# EAGLE design rakboard2_pre (EAGLE 7.7.0)
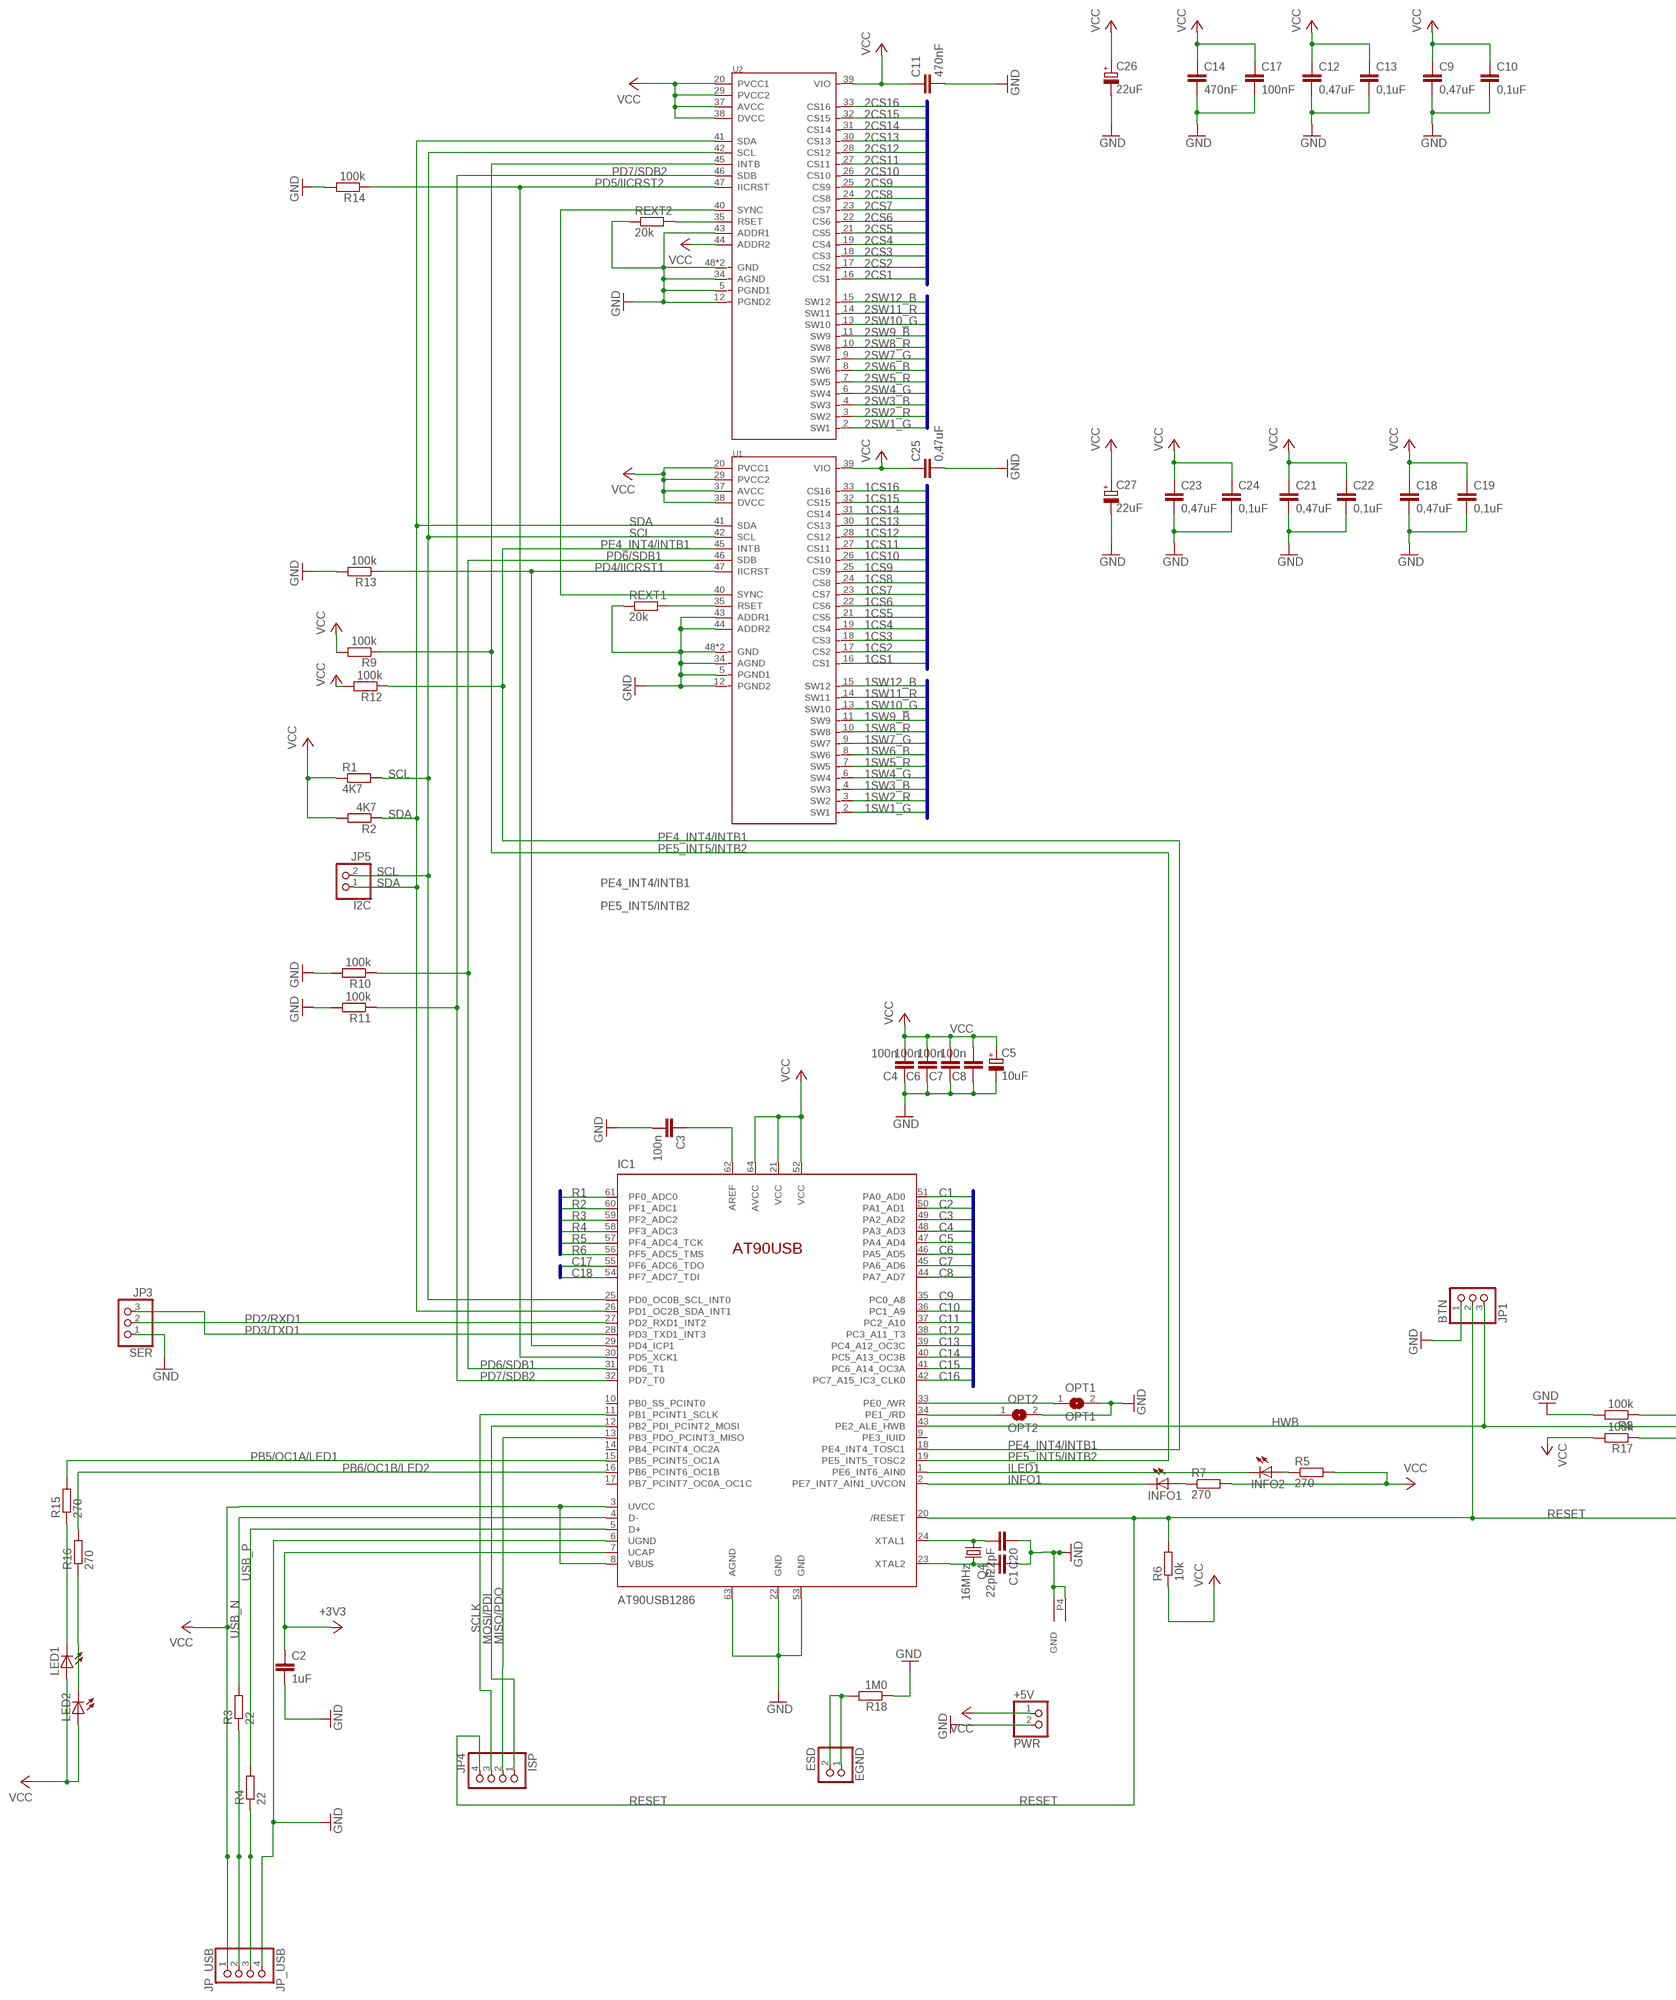
[diagram p0: schematic, sheet 1, part 1 of 2]
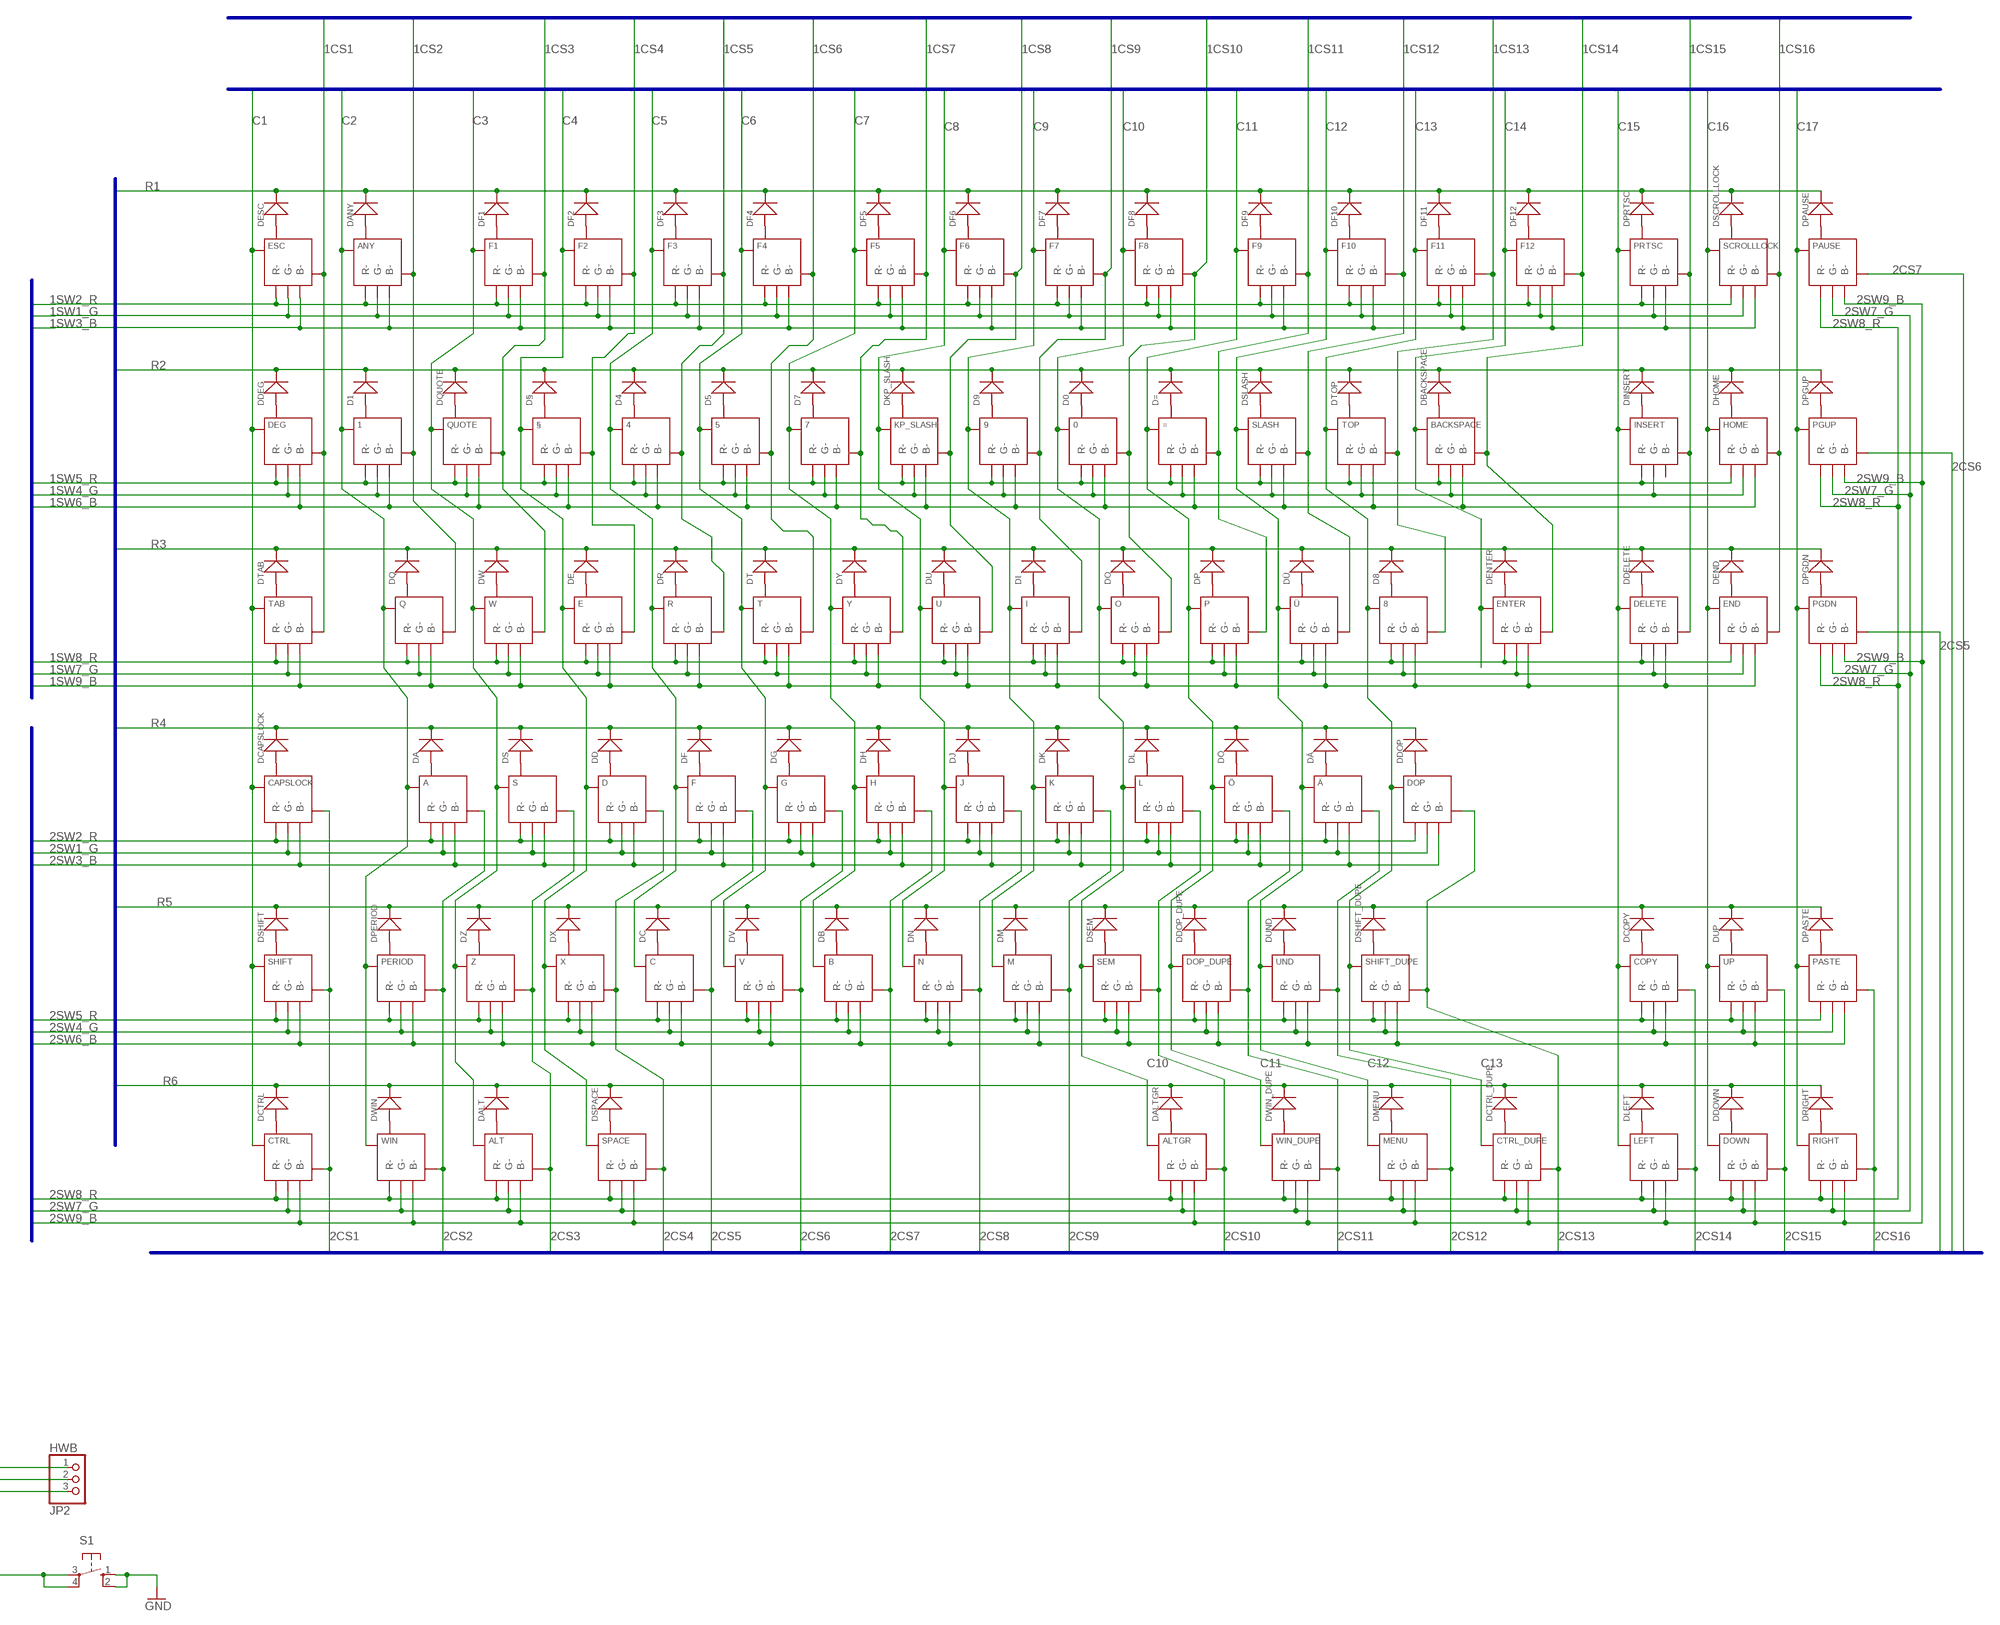
[diagram p1: schematic, sheet 1, part 2 of 2]

## Parts
0  KEYSWITCH-RGBLED-ALPSMX-1U-RGB  [ALPSMX-1U-RGB]
1  KEYSWITCH-RGBLED-ALPSMX-1U-RGB  [ALPSMX-1U-RGB]
4  KEYSWITCH-RGBLED-ALPSMX-1U-RGB  [ALPSMX-1U-RGB]
5  KEYSWITCH-RGBLED-ALPSMX-1U-RGB  [ALPSMX-1U-RGB]
7  KEYSWITCH-RGBLED-ALPSMX-1U-RGB  [ALPSMX-1U-RGB]
8  KEYSWITCH-RGBLED-ALPSMX-1U-RGB  [ALPSMX-1U-RGB]
9  KEYSWITCH-RGBLED-ALPSMX-1U-RGB  [ALPSMX-1U-RGB]
+5V  PWR  PINHD-1X2  [1X02]
=  KEYSWITCH-RGBLED-ALPSMX-1U-RGB  [ALPSMX-1U-RGB]
A  KEYSWITCH-RGBLED-ALPSMX-1U-RGB  [ALPSMX-1U-RGB]
ALT  KEYSWITCH-RGBLED-ALPSMX-1U-RGB  [ALPSMX-1U-RGB]
ALTGR  KEYSWITCH-RGBLED-ALPSMX-1U-RGB  [ALPSMX-1U-RGB]
ANY  KEYSWITCH-RGBLED-ALPSMX-1U-RGB  [ALPSMX-1U-RGB]
B  KEYSWITCH-RGBLED-ALPSMX-1U-RGB  [ALPSMX-1U-RGB]
BACKSPACE  KEYSWITCH-RGBLED-ALPSMX-2U-RGB  [ALPSMX-2U-RGB]
BTN  JP1  PINHD-1X3  [1X03]
C  KEYSWITCH-RGBLED-ALPSMX-1U-RGB  [ALPSMX-1U-RGB]
C1  22pF  C-EUC1206  [C1206]
C2  1uF  C-EUC1206  [C1206]
C3  100n  C-EUC1206  [C1206]
C4  100n  C-EUC1206  [C1206]
C5  10uF  CPOL-EUE2-4  [E2-4]
C6  100n  C-EUC1206  [C1206]
C7  100n  C-EUC1206  [C1206]
C8  100n  C-EUC1206  [C1206]
C9  0,47uF  C-EUC1206  [C1206]
C10  0,1uF  C-EUC1206  [C1206]
C11  470nF  C-EUC1206  [C1206]
C12  0,47uF  C-EUC1206  [C1206]
C13  0,1uF  C-EUC1206  [C1206]
C14  470nF  C-EUC1206  [C1206]
C17  100nF  C-EUC1206  [C1206]
C18  0,47uF  C-EUC1206  [C1206]
C19  0,1uF  C-EUC1206  [C1206]
C20  22pF  C-EUC1206  [C1206]
C21  0,47uF  C-EUC1206  [C1206]
C22  0,1uF  C-EUC1206  [C1206]
C23  0,47uF  C-EUC1206  [C1206]
C24  0,1uF  C-EUC1206  [C1206]
C25  0,47uF  C-EUC1206  [C1206]
C26  22uF  CPOL-EUE2-4  [E2-4]
C27  22uF  CPOL-EUE2-4  [E2-4]
CAPSLOCK  KEYSWITCH-RGBLED-ALPSMX-1U-RGB  [ALPSMX-1U-RGB]
COPY  KEYSWITCH-RGBLED-ALPSMX-1U-RGB  [ALPSMX-1U-RGB]
CTRL  KEYSWITCH-RGBLED-ALPSMX-1U-RGB  [ALPSMX-1U-RGB]
CTRL_DUPE  KEYSWITCH-RGBLED-ALPSMX-1U-RGB  [ALPSMX-1U-RGB]
D  KEYSWITCH-RGBLED-ALPSMX-1U-RGB  [ALPSMX-1U-RGB]
D0  DIODE'1N4148'  [DO-35]
D1  DIODE'1N4148'  [DO-35]
D4  DIODE'1N4148'  [DO-35]
D5  DIODE'1N4148'  [DO-35]
D7  DIODE'1N4148'  [DO-35]
D8  DIODE'1N4148'  [DO-35]
D9  DIODE'1N4148'  [DO-35]
D=  DIODE'1N4148'  [DO-35]
DA  DIODE'1N4148'  [DO-35]
DALT  DIODE'1N4148'  [DO-35]
DALTGR  DIODE'1N4148'  [DO-35]
DANY  DIODE'1N4148'  [DO-35]
DB  DIODE'1N4148'  [DO-35]
DBACKSPACE  DIODE'1N4148'  [DO-35]
DC  DIODE'1N4148'  [DO-35]
DCAPSLOCK  DIODE'1N4148'  [DO-35]
DCOPY  DIODE'1N4148'  [DO-35]
DCTRL  DIODE'1N4148'  [DO-35]
DCTRL_DUPE  DIODE'1N4148'  [DO-35]
DD  DIODE'1N4148'  [DO-35]
DDEG  DIODE'1N4148'  [DO-35]
DDELETE  DIODE'1N4148'  [DO-35]
DDOP  DIODE'1N4148'  [DO-35]
DDOP_DUPE  DIODE'1N4148'  [DO-35]
DDOWN  DIODE'1N4148'  [DO-35]
DE  DIODE'1N4148'  [DO-35]
DEG  KEYSWITCH-RGBLED-ALPSMX-1U-RGB  [ALPSMX-1U-RGB]
DELETE  KEYSWITCH-RGBLED-ALPSMX-1U-RGB  [ALPSMX-1U-RGB]
DEND  DIODE'1N4148'  [DO-35]
DENTER  DIODE'1N4148'  [DO-35]
DESC  DIODE'1N4148'  [DO-35]
DF  DIODE'1N4148'  [DO-35]
DF1  DIODE'1N4148'  [DO-35]
DF2  DIODE'1N4148'  [DO-35]
DF3  DIODE'1N4148'  [DO-35]
DF4  DIODE'1N4148'  [DO-35]
DF5  DIODE'1N4148'  [DO-35]
DF6  DIODE'1N4148'  [DO-35]
DF7  DIODE'1N4148'  [DO-35]
DF8  DIODE'1N4148'  [DO-35]
DF9  DIODE'1N4148'  [DO-35]
DF10  DIODE'1N4148'  [DO-35]
DF11  DIODE'1N4148'  [DO-35]
DF12  DIODE'1N4148'  [DO-35]
DG  DIODE'1N4148'  [DO-35]
DH  DIODE'1N4148'  [DO-35]
DHOME  DIODE'1N4148'  [DO-35]
DI  DIODE'1N4148'  [DO-35]
DINSERT  DIODE'1N4148'  [DO-35]
DJ  DIODE'1N4148'  [DO-35]
DK  DIODE'1N4148'  [DO-35]
DKP_SLASH  DIODE'1N4148'  [DO-35]
DL  DIODE'1N4148'  [DO-35]
DLEFT  DIODE'1N4148'  [DO-35]
DM  DIODE'1N4148'  [DO-35]
DMENU  DIODE'1N4148'  [DO-35]
DN  DIODE'1N4148'  [DO-35]
DO  DIODE'1N4148'  [DO-35]
DOP  KEYSWITCH-RGBLED-ALPSMX-1U-RGB  [ALPSMX-1U-RGB]
DOP_DUPE  KEYSWITCH-RGBLED-ALPSMX-1U-RGB  [ALPSMX-1U-RGB]
DOWN  KEYSWITCH-RGBLED-ALPSMX-1U-RGB  [ALPSMX-1U-RGB]
DP  DIODE'1N4148'  [DO-35]
DPASTE  DIODE'1N4148'  [DO-35]
DPAUSE  DIODE'1N4148'  [DO-35]
DPERIOD  DIODE'1N4148'  [DO-35]
DPGDN  DIODE'1N4148'  [DO-35]
DPGUP  DIODE'1N4148'  [DO-35]
DPRTSC  DIODE'1N4148'  [DO-35]
DQ  DIODE'1N4148'  [DO-35]
DQUOTE  DIODE'1N4148'  [DO-35]
DR  DIODE'1N4148'  [DO-35]
DRIGHT  DIODE'1N4148'  [DO-35]
DS  DIODE'1N4148'  [DO-35]
DSCROLLLOCK  DIODE'1N4148'  [DO-35]
DSEM  DIODE'1N4148'  [DO-35]
DSHIFT  DIODE'1N4148'  [DO-35]
DSHIFT_DUPE  DIODE'1N4148'  [DO-35]
DSLASH  DIODE'1N4148'  [DO-35]
DSPACE  DIODE'1N4148'  [DO-35]
DT  DIODE'1N4148'  [DO-35]
DTAB  DIODE'1N4148'  [DO-35]
DTOP  DIODE'1N4148'  [DO-35]
DU  DIODE'1N4148'  [DO-35]
DUND  DIODE'1N4148'  [DO-35]
DUP  DIODE'1N4148'  [DO-35]
DV  DIODE'1N4148'  [DO-35]
DW  DIODE'1N4148'  [DO-35]
DWIN  DIODE'1N4148'  [DO-35]
DWIN_DUPE  DIODE'1N4148'  [DO-35]
DX  DIODE'1N4148'  [DO-35]
DY  DIODE'1N4148'  [DO-35]
DZ  DIODE'1N4148'  [DO-35]
D§  DIODE'1N4148'  [DO-35]
DÄ  DIODE'1N4148'  [DO-35]
DÖ  DIODE'1N4148'  [DO-35]
DÜ  DIODE'1N4148'  [DO-35]
E  KEYSWITCH-RGBLED-ALPSMX-1U-RGB  [ALPSMX-1U-RGB]
EGND  ESD  PINHD-1X2  [1X02]
END  KEYSWITCH-RGBLED-ALPSMX-1U-RGB  [ALPSMX-1U-RGB]
ENTER  KEYSWITCH-RGBLED-ALPSMX-2U-RGB  [ALPSMX-2U-RGB]
ESC  KEYSWITCH-RGBLED-ALPSMX-1U-RGB  [ALPSMX-1U-RGB]
F  KEYSWITCH-RGBLED-ALPSMX-1U-RGB  [ALPSMX-1U-RGB]
F1  KEYSWITCH-RGBLED-ALPSMX-1U-RGB  [ALPSMX-1U-RGB]
F2  KEYSWITCH-RGBLED-ALPSMX-1U-RGB  [ALPSMX-1U-RGB]
F3  KEYSWITCH-RGBLED-ALPSMX-1U-RGB  [ALPSMX-1U-RGB]
F4  KEYSWITCH-RGBLED-ALPSMX-1U-RGB  [ALPSMX-1U-RGB]
F5  KEYSWITCH-RGBLED-ALPSMX-1U-RGB  [ALPSMX-1U-RGB]
F6  KEYSWITCH-RGBLED-ALPSMX-1U-RGB  [ALPSMX-1U-RGB]
F7  KEYSWITCH-RGBLED-ALPSMX-1U-RGB  [ALPSMX-1U-RGB]
F8  KEYSWITCH-RGBLED-ALPSMX-1U-RGB  [ALPSMX-1U-RGB]
F9  KEYSWITCH-RGBLED-ALPSMX-1U-RGB  [ALPSMX-1U-RGB]
F10  KEYSWITCH-RGBLED-ALPSMX-1U-RGB  [ALPSMX-1U-RGB]
F11  KEYSWITCH-RGBLED-ALPSMX-1U-RGB  [ALPSMX-1U-RGB]
F12  KEYSWITCH-RGBLED-ALPSMX-1U-RGB  [ALPSMX-1U-RGB]
G  KEYSWITCH-RGBLED-ALPSMX-1U-RGB  [ALPSMX-1U-RGB]
H  KEYSWITCH-RGBLED-ALPSMX-1U-RGB  [ALPSMX-1U-RGB]
HOME  KEYSWITCH-RGBLED-ALPSMX-1U-RGB  [ALPSMX-1U-RGB]
HWB  JP2  PINHD-1X3  [1X03]
I  KEYSWITCH-RGBLED-ALPSMX-1U-RGB  [ALPSMX-1U-RGB]
I2C  JP5  PINHD-1X2  [1X02]
IC1  AT90USB1286  AT90USB-TQFP  [TQFP64]
INFO1  LEDSML0805  [SML0805]
INFO2  LEDSML0805  [SML0805]
INSERT  KEYSWITCH-RGBLED-ALPSMX-1U-RGB  [ALPSMX-1U-RGB]
ISP  JP4  PINHD-1X4  [1X04]
J  KEYSWITCH-RGBLED-ALPSMX-1U-RGB  [ALPSMX-1U-RGB]
JP_USB  JP_USB  PINHD-1X4  [1X04]
K  KEYSWITCH-RGBLED-ALPSMX-1U-RGB  [ALPSMX-1U-RGB]
KP_SLASH  KEYSWITCH-RGBLED-ALPSMX-1U-RGB  [ALPSMX-1U-RGB]
L  KEYSWITCH-RGBLED-ALPSMX-1U-RGB  [ALPSMX-1U-RGB]
LED1  LED3MM  [LED3MM]
LED2  LED3MM  [LED3MM]
LEFT  KEYSWITCH-RGBLED-ALPSMX-1U-RGB  [ALPSMX-1U-RGB]
M  KEYSWITCH-RGBLED-ALPSMX-1U-RGB  [ALPSMX-1U-RGB]
MENU  KEYSWITCH-RGBLED-ALPSMX-1U-RGB  [ALPSMX-1U-RGB]
N  KEYSWITCH-RGBLED-ALPSMX-1U-RGB  [ALPSMX-1U-RGB]
O  KEYSWITCH-RGBLED-ALPSMX-1U-RGB  [ALPSMX-1U-RGB]
OPT1  OPT1  SJ  [SJ]
OPT2  OPT2  SJ  [SJ]
P  KEYSWITCH-RGBLED-ALPSMX-1U-RGB  [ALPSMX-1U-RGB]
PASTE  KEYSWITCH-RGBLED-ALPSMX-1U-RGB  [ALPSMX-1U-RGB]
PAUSE  KEYSWITCH-RGBLED-ALPSMX-1U-RGB  [ALPSMX-1U-RGB]
PERIOD  KEYSWITCH-RGBLED-ALPSMX-1U-RGB  [ALPSMX-1U-RGB]
PGDN  KEYSWITCH-RGBLED-ALPSMX-1U-RGB  [ALPSMX-1U-RGB]
PGUP  KEYSWITCH-RGBLED-ALPSMX-1U-RGB  [ALPSMX-1U-RGB]
PRTSC  KEYSWITCH-RGBLED-ALPSMX-1U-RGB  [ALPSMX-1U-RGB]
Q  KEYSWITCH-RGBLED-ALPSMX-1U-RGB  [ALPSMX-1U-RGB]
Q4  16MHz  CRYSTALMJ  [MJ]
QUOTE  KEYSWITCH-RGBLED-ALPSMX-1U-RGB  [ALPSMX-1U-RGB]
R  KEYSWITCH-RGBLED-ALPSMX-1U-RGB  [ALPSMX-1U-RGB]
R1  4K7  R-EU_R1206  [R1206]
R2  4K7  R-EU_R1206  [R1206]
R3  22  R-EU_R1206  [R1206]
R4  22  R-EU_R1206  [R1206]
R5  270  R-EU_R1206  [R1206]
R6  10k  R-EU_R1206  [R1206]
R7  270  R-EU_R1206  [R1206]
R8  100k  R-EU_R1206  [R1206]
R9  100k  R-EU_R1206  [R1206]
R10  100k  R-EU_R1206  [R1206]
R11  100k  R-EU_R1206  [R1206]
R12  100k  R-EU_R1206  [R1206]
R13  100k  R-EU_R1206  [R1206]
R14  100k  R-EU_R1206  [R1206]
R15  270  R-EU_R1206  [R1206]
R16  270  R-EU_R1206  [R1206]
R17  100k  R-EU_R1206  [R1206]
R18  1M0  R-EU_R1206  [R1206]
REXT1  20k  R-EU_R1206  [R1206]
REXT2  20k  R-EU_R1206  [R1206]
RIGHT  KEYSWITCH-RGBLED-ALPSMX-1U-RGB  [ALPSMX-1U-RGB]
S  KEYSWITCH-RGBLED-ALPSMX-1U-RGB  [ALPSMX-1U-RGB]
S1  10-XX  [B3F-10XX]
SCROLLLOCK  KEYSWITCH-RGBLED-ALPSMX-1U-RGB  [ALPSMX-1U-RGB]
SEM  KEYSWITCH-RGBLED-ALPSMX-1U-RGB  [ALPSMX-1U-RGB]
SER  JP3  PINHD-1X3  [1X03]
SHIFT  KEYSWITCH-RGBLED-ALPSMX-1U-RGB  [ALPSMX-1U-RGB]
SHIFT_DUPE  KEYSWITCH-RGBLED-ALPSMX-2U-RGB  [ALPSMX-2U-RGB]
SLASH  KEYSWITCH-RGBLED-ALPSMX-1U-RGB  [ALPSMX-1U-RGB]
SPACE  KEYSWITCH-RGBLED-ALPSMX-6.25U-RGB  [ALPSMX-6.25U-RGB]
T  KEYSWITCH-RGBLED-ALPSMX-1U-RGB  [ALPSMX-1U-RGB]
TAB  KEYSWITCH-RGBLED-ALPSMX-1U-RGB  [ALPSMX-1U-RGB]
TOP  KEYSWITCH-RGBLED-ALPSMX-1U-RGB  [ALPSMX-1U-RGB]
U  KEYSWITCH-RGBLED-ALPSMX-1U-RGB  [ALPSMX-1U-RGB]
U1  IS31FL3733  [LQFP48_7X7]
U2  IS31FL3733  [LQFP48_7X7]
UND  KEYSWITCH-RGBLED-ALPSMX-1U-RGB  [ALPSMX-1U-RGB]
UP  KEYSWITCH-RGBLED-ALPSMX-1U-RGB  [ALPSMX-1U-RGB]
V  KEYSWITCH-RGBLED-ALPSMX-1U-RGB  [ALPSMX-1U-RGB]
W  KEYSWITCH-RGBLED-ALPSMX-1U-RGB  [ALPSMX-1U-RGB]
WIN  KEYSWITCH-RGBLED-ALPSMX-1U-RGB  [ALPSMX-1U-RGB]
WIN_DUPE  KEYSWITCH-RGBLED-ALPSMX-1U-RGB  [ALPSMX-1U-RGB]
X  KEYSWITCH-RGBLED-ALPSMX-1U-RGB  [ALPSMX-1U-RGB]
Y  KEYSWITCH-RGBLED-ALPSMX-1U-RGB  [ALPSMX-1U-RGB]
Z  KEYSWITCH-RGBLED-ALPSMX-1U-RGB  [ALPSMX-1U-RGB]
§  KEYSWITCH-RGBLED-ALPSMX-1U-RGB  [ALPSMX-1U-RGB]
Ä  KEYSWITCH-RGBLED-ALPSMX-1U-RGB  [ALPSMX-1U-RGB]
Ö  KEYSWITCH-RGBLED-ALPSMX-1U-RGB  [ALPSMX-1U-RGB]
Ü  KEYSWITCH-RGBLED-ALPSMX-1U-RGB  [ALPSMX-1U-RGB]

## Nets
1CS1 [leddriver]: DEG.LED+ ESC.LED+ TAB.LED+ U1.16(CS1)
1CS2 [leddriver]: 1.LED+ ANY.LED+ Q.LED+ U1.17(CS2)
1CS3 [leddriver]: F1.LED+ QUOTE.LED+ U1.18(CS3) W.LED+
1CS4 [leddriver]: E.LED+ F2.LED+ U1.19(CS4) §.LED+
1CS5 [leddriver]: 4.LED+ F3.LED+ R.LED+ U1.21(CS5)
1CS6 [leddriver]: 5.LED+ F4.LED+ T.LED+ U1.22(CS6)
1CS7 [leddriver]: 7.LED+ F5.LED+ U1.23(CS7) Y.LED+
1CS8 [leddriver]: F6.LED+ KP_SLASH.LED+ U1.24(CS8) U.LED+
1CS9 [leddriver]: 9.LED+ F7.LED+ I.LED+ U1.25(CS9)
1CS10 [leddriver]: 0.LED+ F8.LED+ O.LED+ U1.26(CS10)
1CS11 [leddriver]: =.LED+ F9.LED+ P.LED+ U1.27(CS11)
1CS12 [leddriver]: F10.LED+ SLASH.LED+ U1.28(CS12) Ü.LED+
1CS13 [leddriver]: 8.LED+ F11.LED+ TOP.LED+ U1.30(CS13)
1CS14 [leddriver]: BACKSPACE.LED+ ENTER.LED+ F12.LED+ U1.31(CS14)
1CS15 [leddriver]: DELETE.LED+ INSERT.LED+ PRTSC.LED+ U1.32(CS15)
1CS16 [leddriver]: END.LED+ HOME.LED+ SCROLLLOCK.LED+ U1.33(CS16)
1SW1_G [leddriver]: ANY.G- ESC.G- F1.G- F2.G- F3.G- F4.G- F5.G- F6.G- F7.G- F8.G- F9.G- F10.G- F11.G- F12.G- PRTSC.G- SCROLLLOCK.G- U1.2(SW1)
1SW2_R [leddriver]: ANY.R- ESC.R- F1.R- F2.R- F3.R- F4.R- F5.R- F6.R- F7.R- F8.R- F9.R- F10.R- F11.R- F12.R- PRTSC.R- SCROLLLOCK.R- U1.3(SW2)
1SW3_B [leddriver]: ANY.B- ESC.B- F1.B- F2.B- F3.B- F4.B- F5.B- F6.B- F7.B- F8.B- F9.B- F10.B- F11.B- F12.B- PRTSC.B- SCROLLLOCK.B- U1.4(SW3)
1SW4_G [leddriver]: 0.G- 1.G- 4.G- 5.G- 7.G- 9.G- =.G- BACKSPACE.G- DEG.G- HOME.G- INSERT.G- KP_SLASH.G- QUOTE.G- SLASH.G- TOP.G- U1.6(SW4) §.G-
1SW5_R [leddriver]: 0.R- 1.R- 4.R- 5.R- 7.R- 9.R- =.R- BACKSPACE.R- DEG.R- HOME.R- INSERT.R- KP_SLASH.R- QUOTE.R- SLASH.R- TOP.R- U1.7(SW5) §.R-
1SW6_B: 0.B- 1.B- 4.B- 5.B- 7.B- 9.B- =.B- BACKSPACE.B- DEG.B- HOME.B- KP_SLASH.B- QUOTE.B- SLASH.B- TOP.B- U1.8(SW6) §.B-
1SW7_G [leddriver]: 8.G- DELETE.G- E.G- END.G- ENTER.G- I.G- O.G- P.G- Q.G- R.G- T.G- TAB.G- U1.9(SW7) U.G- W.G- Y.G- Ü.G-
1SW8_R [leddriver]: 8.R- DELETE.R- E.R- END.R- ENTER.R- I.R- O.R- P.R- Q.R- R.R- T.R- TAB.R- U1.10(SW8) U.R- W.R- Y.R- Ü.R-
1SW9_B [leddriver]: 8.B- DELETE.B- E.B- END.B- ENTER.B- I.B- O.B- P.B- Q.B- R.B- T.B- TAB.B- U1.11(SW9) U.B- W.B- Y.B- Ü.B-
1SW10_G [leddriver]: U1.13(SW10)
1SW11_R [leddriver]: U1.14(SW11)
1SW12_B [leddriver]: U1.15(SW12)
2CS1 [leddriver]: CAPSLOCK.LED+ CTRL.LED+ SHIFT.LED+ U2.16(CS1)
2CS2 [leddriver]: A.LED+ PERIOD.LED+ U2.17(CS2) WIN.LED+
2CS3 [leddriver]: ALT.LED+ S.LED+ U2.18(CS3) Z.LED+
2CS4 [leddriver]: D.LED+ SPACE.LED+ U2.19(CS4) X.LED+
2CS5 [leddriver]: C.LED+ F.LED+ PGDN.LED+ U2.21(CS5)
2CS6 [leddriver]: G.LED+ PGUP.LED+ U2.22(CS6) V.LED+
2CS7 [leddriver]: B.LED+ H.LED+ PAUSE.LED+ U2.23(CS7)
2CS8 [leddriver]: J.LED+ N.LED+ U2.24(CS8)
2CS9 [leddriver]: K.LED+ M.LED+ U2.25(CS9)
2CS10 [leddriver]: ALTGR.LED+ L.LED+ SEM.LED+ U2.26(CS10)
2CS11 [leddriver]: DOP_DUPE.LED+ U2.27(CS11) WIN_DUPE.LED+ Ö.LED+
2CS12 [leddriver]: MENU.LED+ U2.28(CS12) UND.LED+ Ä.LED+
2CS13 [leddriver]: CTRL_DUPE.LED+ DOP.LED+ SHIFT_DUPE.LED+ U2.30(CS13)
2CS14 [leddriver]: COPY.LED+ LEFT.LED+ U2.31(CS14)
2CS15 [leddriver]: DOWN.LED+ U2.32(CS15) UP.LED+
2CS16 [leddriver]: PASTE.LED+ RIGHT.LED+ U2.33(CS16)
2SW1_G [leddriver]: A.G- CAPSLOCK.G- D.G- DOP.G- F.G- G.G- H.G- J.G- K.G- L.G- S.G- U2.2(SW1) Ä.G- Ö.G-
2SW2_R [leddriver]: A.R- CAPSLOCK.R- D.R- DOP.R- F.R- G.R- H.R- J.R- K.R- L.R- S.R- U2.3(SW2) Ä.R- Ö.R-
2SW3_B [leddriver]: A.B- CAPSLOCK.B- D.B- DOP.B- F.B- G.B- H.B- J.B- K.B- L.B- S.B- U2.4(SW3) Ä.B- Ö.B-
2SW4_G [leddriver]: B.G- C.G- COPY.G- DOP_DUPE.G- M.G- N.G- PASTE.G- PERIOD.G- SEM.G- SHIFT.G- SHIFT_DUPE.G- U2.6(SW4) UND.G- UP.G- V.G- X.G- Z.G-
2SW5_R [leddriver]: B.R- C.R- COPY.R- DOP_DUPE.R- M.R- N.R- PASTE.R- PERIOD.R- SEM.R- SHIFT.R- SHIFT_DUPE.R- U2.7(SW5) UND.R- UP.R- V.R- X.R- Z.R-
2SW6_B [leddriver]: B.B- C.B- COPY.B- DOP_DUPE.B- M.B- N.B- PASTE.B- PERIOD.B- SEM.B- SHIFT.B- SHIFT_DUPE.B- U2.8(SW6) UND.B- UP.B- V.B- X.B- Z.B-
2SW7_G [leddriver]: ALT.G- ALTGR.G- CTRL.G- CTRL_DUPE.G- DOWN.G- LEFT.G- MENU.G- PAUSE.G- PGDN.G- PGUP.G- RIGHT.G- SPACE.G- U2.9(SW7) WIN.G- WIN_DUPE.G-
2SW8_R [leddriver]: ALT.R- ALTGR.R- CTRL.R- CTRL_DUPE.R- DOWN.R- LEFT.R- MENU.R- PAUSE.R- PGDN.R- PGUP.R- RIGHT.R- SPACE.R- U2.10(SW8) WIN.R- WIN_DUPE.R-
2SW9_B [leddriver]: ALT.B- ALTGR.B- CTRL.B- CTRL_DUPE.B- DOWN.B- LEFT.B- MENU.B- PAUSE.B- PGDN.B- PGUP.B- RIGHT.B- SPACE.B- U2.11(SW9) WIN.B- WIN_DUPE.B-
2SW10_G [leddriver]: U2.13(SW10)
2SW11_R [leddriver]: U2.14(SW11)
2SW12_B [leddriver]: U2.15(SW12)
+3V3: C2.1 IC1.7(UCAP)
C1 [keyboard]: CAPSLOCK.ALPS1(P0) CAPSLOCK.MX1(P0) CTRL.ALPS1(P0) CTRL.MX1(P0) DEG.ALPS1(P0) DEG.MX1(P0) ESC.ALPS1(P0) ESC.MX1(P0) IC1.51(PA0_AD0) SHIFT.ALPS1(P0) SHIFT.MX1(P0) TAB.ALPS1(P0) TAB.MX1(P0)
C2 [keyboard]: 1.ALPS1(P0) 1.MX1(P0) A.ALPS1(P0) A.MX1(P0) ANY.ALPS1(P0) ANY.MX1(P0) IC1.50(PA1_AD1) PERIOD.ALPS1(P0) PERIOD.MX1(P0) Q.ALPS1(P0) Q.MX1(P0) WIN.ALPS1(P0) WIN.MX1(P0)
C3 [keyboard]: ALT.ALPS1(P0) ALT.MX1(P0) F1.ALPS1(P0) F1.MX1(P0) IC1.49(PA2_AD2) QUOTE.ALPS1(P0) QUOTE.MX1(P0) S.ALPS1(P0) S.MX1(P0) W.ALPS1(P0) W.MX1(P0) Z.ALPS1(P0) Z.MX1(P0)
C4 [keyboard]: D.ALPS1(P0) D.MX1(P0) E.ALPS1(P0) E.MX1(P0) F2.ALPS1(P0) F2.MX1(P0) IC1.48(PA3_AD3) SPACE.ALPS1(P0) SPACE.MX1(P0) X.ALPS1(P0) X.MX1(P0) §.ALPS1(P0) §.MX1(P0)
C5 [keyboard]: 4.ALPS1(P0) 4.MX1(P0) C.ALPS1(P0) C.MX1(P0) F3.ALPS1(P0) F3.MX1(P0) F.ALPS1(P0) F.MX1(P0) IC1.47(PA4_AD4) R.ALPS1(P0) R.MX1(P0)
C6 [keyboard]: 5.ALPS1(P0) 5.MX1(P0) F4.ALPS1(P0) F4.MX1(P0) G.ALPS1(P0) G.MX1(P0) IC1.46(PA5_AD5) T.ALPS1(P0) T.MX1(P0) V.ALPS1(P0) V.MX1(P0)
C7 [keyboard]: 7.ALPS1(P0) 7.MX1(P0) B.ALPS1(P0) B.MX1(P0) F5.ALPS1(P0) F5.MX1(P0) H.ALPS1(P0) H.MX1(P0) IC1.45(PA6_AD6) Y.ALPS1(P0) Y.MX1(P0)
C8 [keyboard]: F6.ALPS1(P0) F6.MX1(P0) IC1.44(PA7_AD7) J.ALPS1(P0) J.MX1(P0) KP_SLASH.ALPS1(P0) KP_SLASH.MX1(P0) N.ALPS1(P0) N.MX1(P0) U.ALPS1(P0) U.MX1(P0)
C9 [keyboard]: 9.ALPS1(P0) 9.MX1(P0) F7.ALPS1(P0) F7.MX1(P0) I.ALPS1(P0) I.MX1(P0) IC1.35(PC0_A8) K.ALPS1(P0) K.MX1(P0) M.ALPS1(P0) M.MX1(P0)
C10 [keyboard]: 0.ALPS1(P0) 0.MX1(P0) ALTGR.ALPS1(P0) ALTGR.MX1(P0) F8.ALPS1(P0) F8.MX1(P0) IC1.36(PC1_A9) L.ALPS1(P0) L.MX1(P0) O.ALPS1(P0) O.MX1(P0) SEM.ALPS1(P0) SEM.MX1(P0)
C11 [keyboard]: =.ALPS1(P0) =.MX1(P0) DOP_DUPE.ALPS1(P0) DOP_DUPE.MX1(P0) F9.ALPS1(P0) F9.MX1(P0) IC1.37(PC2_A10) P.ALPS1(P0) P.MX1(P0) WIN_DUPE.ALPS1(P0) WIN_DUPE.MX1(P0) Ö.ALPS1(P0) Ö.MX1(P0)
C12 [keyboard]: F10.ALPS1(P0) F10.MX1(P0) IC1.38(PC3_A11_T3) MENU.ALPS1(P0) MENU.MX1(P0) SLASH.ALPS1(P0) SLASH.MX1(P0) UND.ALPS1(P0) UND.MX1(P0) Ä.ALPS1(P0) Ä.MX1(P0) Ü.ALPS1(P0) Ü.MX1(P0)
C13 [keyboard]: 8.ALPS1(P0) 8.MX1(P0) CTRL_DUPE.ALPS1(P0) CTRL_DUPE.MX1(P0) DOP.ALPS1(P0) DOP.MX1(P0) F11.ALPS1(P0) F11.MX1(P0) IC1.39(PC4_A12_OC3C) SHIFT_DUPE.ALPS1(P0) SHIFT_DUPE.MX1(P0) TOP.ALPS1(P0) TOP.MX1(P0)
C14 [keyboard]: BACKSPACE.ALPS1(P0) BACKSPACE.MX1(P0) ENTER.ALPS1(P0) ENTER.MX1(P0) F12.ALPS1(P0) F12.MX1(P0) IC1.40(PC5_A13_OC3B)
C15 [keyboard]: COPY.ALPS1(P0) COPY.MX1(P0) DELETE.ALPS1(P0) DELETE.MX1(P0) IC1.41(PC6_A14_OC3A) INSERT.ALPS1(P0) INSERT.MX1(P0) LEFT.ALPS1(P0) LEFT.MX1(P0) PRTSC.ALPS1(P0) PRTSC.MX1(P0)
C16 [keyboard]: DOWN.ALPS1(P0) DOWN.MX1(P0) END.ALPS1(P0) END.MX1(P0) HOME.ALPS1(P0) HOME.MX1(P0) IC1.42(PC7_A15_IC3_CLK0) SCROLLLOCK.ALPS1(P0) SCROLLLOCK.MX1(P0) UP.ALPS1(P0) UP.MX1(P0)
C17 [keyboard]: IC1.55(PF6_ADC6_TDO) PASTE.ALPS1(P0) PASTE.MX1(P0) PAUSE.ALPS1(P0) PAUSE.MX1(P0) PGDN.ALPS1(P0) PGDN.MX1(P0) PGUP.ALPS1(P0) PGUP.MX1(P0) RIGHT.ALPS1(P0) RIGHT.MX1(P0)
C18: IC1.54(PF7_ADC7_TDI)
GND [gnd]: +5V.2 BTN.1 C1.1 C2.2 C3.2 C4.1 C5.- C6.1 C7.1 C8.1 C9.2 C10.2 C11.2 C12.2 C13.2 C14.2 C17.2 C18.2 C19.2 C20.1 C21.2 C22.2 C23.2 C24.2 C25.2 C26.- C27.- IC1.6(UGND) IC1.22(GND) IC1.53(GND) IC1.63(AGND) JP_USB.4 OPT1.2 OPT2.2 Q4.P2(GND) Q4.P4(GND1) R8.2 R10.2 R11.2 R13.2 R14.2 R18.1 REXT1.1 REXT2.1 S1.1(S) S1.2(S1) SER.1 U1.5(PGND1) U1.12(PGND2) U1.34(AGND) U1.43(ADDR1) U1.44(ADDR2) U1.48(GND) U1.TP(GND) U2.5(PGND1) U2.12(PGND2) U2.34(AGND) U2.43(ADDR1) U2.48(GND) U2.TP(GND)
HWB: BTN.3 HWB.2 IC1.43(PE2_ALE_HWB)
ILED1: IC1.1(PE6_INT6_AIN0) INFO2.C
INFO1: IC1.2(PE7_INT7_AIN1_UVCON) INFO1.C
ISSI_SYNC: U1.40(SYNC) U2.40(SYNC)
MISO/PDO: IC1.13(PB3_PDO_PCINT3_MISO) ISP.2
MOSI/PDI: IC1.12(PB2_PDI_PCINT2_MOSI) ISP.1
N$1: DESC.A(+) ESC.ALPS2(P1) ESC.MX2(P1)
N$3: INFO1.A R7.1
N$6: REXT1.2 U1.35(RSET)
N$8: REXT2.2 U2.35(RSET)
N$9: HWB.1 R8.1
N$10: EGND.1 EGND.2 R18.2
N$11: ANY.ALPS2(P1) ANY.MX2(P1) DANY.A(+)
N$12: DF1.A(+) F1.ALPS2(P1) F1.MX2(P1)
N$13: DF2.A(+) F2.ALPS2(P1) F2.MX2(P1)
N$14: DF3.A(+) F3.ALPS2(P1) F3.MX2(P1)
N$15: DF4.A(+) F4.ALPS2(P1) F4.MX2(P1)
N$16: DF5.A(+) F5.ALPS2(P1) F5.MX2(P1)
N$17: DF6.A(+) F6.ALPS2(P1) F6.MX2(P1)
N$18: DF7.A(+) F7.ALPS2(P1) F7.MX2(P1)
N$19: DF8.A(+) F8.ALPS2(P1) F8.MX2(P1)
N$20: DF9.A(+) F9.ALPS2(P1) F9.MX2(P1)
N$21: DF10.A(+) F10.ALPS2(P1) F10.MX2(P1)
N$22: DF11.A(+) F11.ALPS2(P1) F11.MX2(P1)
N$23: HWB.3 R17.1
N$24: C3.1 IC1.62(AREF)
N$26: DF12.A(+) F12.ALPS2(P1) F12.MX2(P1)
N$27: DPRTSC.A(+) PRTSC.ALPS2(P1) PRTSC.MX2(P1)
N$28: DSCROLLLOCK.A(+) SCROLLLOCK.ALPS2(P1) SCROLLLOCK.MX2(P1)
N$29: DPAUSE.A(+) PAUSE.ALPS2(P1) PAUSE.MX2(P1)
N$30: DDEG.A(+) DEG.ALPS2(P1) DEG.MX2(P1)
N$31: 1.ALPS2(P1) 1.MX2(P1) D1.A(+)
N$32: DQUOTE.A(+) QUOTE.ALPS2(P1) QUOTE.MX2(P1)
N$33: D§.A(+) §.ALPS2(P1) §.MX2(P1)
N$34: 4.ALPS2(P1) 4.MX2(P1) D4.A(+)
N$35: 5.ALPS2(P1) 5.MX2(P1) D5.A(+)
N$36: 7.ALPS2(P1) 7.MX2(P1) D7.A(+)
N$37: IC1.33(PE0_/WR) OPT1.1
N$38: DKP_SLASH.A(+) KP_SLASH.ALPS2(P1) KP_SLASH.MX2(P1)
N$40: IC1.34(PE1_/RD) OPT2.1
N$41: 9.ALPS2(P1) 9.MX2(P1) D9.A(+)
N$42: 0.ALPS2(P1) 0.MX2(P1) D0.A(+)
N$43: =.ALPS2(P1) =.MX2(P1) D=.A(+)
N$44: INFO2.A R5.1
N$46: DSLASH.A(+) SLASH.ALPS2(P1) SLASH.MX2(P1)
N$48: DTOP.A(+) TOP.ALPS2(P1) TOP.MX2(P1)
N$49: BACKSPACE.ALPS2(P1) BACKSPACE.MX2(P1) DBACKSPACE.A(+)
N$50: DINSERT.A(+) INSERT.ALPS2(P1) INSERT.MX2(P1)
N$51: DHOME.A(+) HOME.ALPS2(P1) HOME.MX2(P1)
N$52: DPGUP.A(+) PGUP.ALPS2(P1) PGUP.MX2(P1)
N$53: DTAB.A(+) TAB.ALPS2(P1) TAB.MX2(P1)
N$54: DQ.A(+) Q.ALPS2(P1) Q.MX2(P1)
N$55: DW.A(+) W.ALPS2(P1) W.MX2(P1)
N$56: DE.A(+) E.ALPS2(P1) E.MX2(P1)
N$57: DR.A(+) R.ALPS2(P1) R.MX2(P1)
N$58: DT.A(+) T.ALPS2(P1) T.MX2(P1)
N$59: DY.A(+) Y.ALPS2(P1) Y.MX2(P1)
N$60: DU.A(+) U.ALPS2(P1) U.MX2(P1)
N$61: DI.A(+) I.ALPS2(P1) I.MX2(P1)
N$62: DO.A(+) O.ALPS2(P1) O.MX2(P1)
N$63: DP.A(+) P.ALPS2(P1) P.MX2(P1)
N$64: C1.2 IC1.23(XTAL2) Q4.P3
N$65: C20.2 IC1.24(XTAL1) Q4.P1
N$66: DÜ.A(+) Ü.ALPS2(P1) Ü.MX2(P1)
N$67: LED1.K(C) R15.1
N$68: LED2.K(C) R16.1
N$70: 8.ALPS2(P1) 8.MX2(P1) D8.A(+)
N$71: DENTER.A(+) ENTER.ALPS2(P1) ENTER.MX2(P1)
N$72: DDELETE.A(+) DELETE.ALPS2(P1) DELETE.MX2(P1)
N$73: DEND.A(+) END.ALPS2(P1) END.MX2(P1)
N$75: DPGDN.A(+) PGDN.ALPS2(P1) PGDN.MX2(P1)
N$76: CAPSLOCK.ALPS2(P1) CAPSLOCK.MX2(P1) DCAPSLOCK.A(+)
N$77: A.ALPS2(P1) A.MX2(P1) DA.A(+)
N$78: DS.A(+) S.ALPS2(P1) S.MX2(P1)
N$79: D.ALPS2(P1) D.MX2(P1) DD.A(+)
N$80: DF.A(+) F.ALPS2(P1) F.MX2(P1)
N$81: DG.A(+) G.ALPS2(P1) G.MX2(P1)
N$82: DH.A(+) H.ALPS2(P1) H.MX2(P1)
N$83: DJ.A(+) J.ALPS2(P1) J.MX2(P1)
N$84: DK.A(+) K.ALPS2(P1) K.MX2(P1)
N$85: DL.A(+) L.ALPS2(P1) L.MX2(P1)
N$86: DÖ.A(+) Ö.ALPS2(P1) Ö.MX2(P1)
N$87: DÄ.A(+) Ä.ALPS2(P1) Ä.MX2(P1)
N$88: DDOP.A(+) DOP.ALPS2(P1) DOP.MX2(P1)
N$89: DSHIFT.A(+) SHIFT.ALPS2(P1) SHIFT.MX2(P1)
N$90: DPERIOD.A(+) PERIOD.ALPS2(P1) PERIOD.MX2(P1)
N$91: DZ.A(+) Z.ALPS2(P1) Z.MX2(P1)
N$92: DX.A(+) X.ALPS2(P1) X.MX2(P1)
N$93: C.ALPS2(P1) C.MX2(P1) DC.A(+)
N$94: DV.A(+) V.ALPS2(P1) V.MX2(P1)
N$95: B.ALPS2(P1) B.MX2(P1) DB.A(+)
N$96: DN.A(+) N.ALPS2(P1) N.MX2(P1)
N$97: DM.A(+) M.ALPS2(P1) M.MX2(P1)
N$98: DSEM.A(+) SEM.ALPS2(P1) SEM.MX2(P1)
N$99: DDOP_DUPE.A(+) DOP_DUPE.ALPS2(P1) DOP_DUPE.MX2(P1)
N$100: DUND.A(+) UND.ALPS2(P1) UND.MX2(P1)
N$101: DSHIFT_DUPE.A(+) SHIFT_DUPE.ALPS2(P1) SHIFT_DUPE.MX2(P1)
N$102: COPY.ALPS2(P1) COPY.MX2(P1) DCOPY.A(+)
N$103: DUP.A(+) UP.ALPS2(P1) UP.MX2(P1)
N$104: DPASTE.A(+) PASTE.ALPS2(P1) PASTE.MX2(P1)
N$105: CTRL.ALPS2(P1) CTRL.MX2(P1) DCTRL.A(+)
N$106: DWIN.A(+) WIN.ALPS2(P1) WIN.MX2(P1)
N$107: ALT.ALPS2(P1) ALT.MX2(P1) DALT.A(+)
N$108: DSPACE.A(+) SPACE.ALPS2(P1) SPACE.MX2(P1)
N$109: ALTGR.ALPS2(P1) ALTGR.MX2(P1) DALTGR.A(+)
N$110: DWIN_DUPE.A(+) WIN_DUPE.ALPS2(P1) WIN_DUPE.MX2(P1)
N$111: DMENU.A(+) MENU.ALPS2(P1) MENU.MX2(P1)
N$112: CTRL_DUPE.ALPS2(P1) CTRL_DUPE.MX2(P1) DCTRL_DUPE.A(+)
N$113: DLEFT.A(+) LEFT.ALPS2(P1) LEFT.MX2(P1)
N$114: DDOWN.A(+) DOWN.ALPS2(P1) DOWN.MX2(P1)
N$115: DRIGHT.A(+) RIGHT.ALPS2(P1) RIGHT.MX2(P1)
PB5/OC1A/LED1: IC1.15(PB5_PCINT5_OC1A) R15.2
PB6/OC1B/LED2: IC1.16(PB6_PCINT6_OC1B) R16.2
PD2/RXD1: IC1.27(PD2_RXD1_INT2) SER.2
PD3/TXD1: IC1.28(PD3_TXD1_INT3) SER.3
PD4/IICRST1: IC1.29(PD4_ICP1) R13.1 U1.47(IICRST)
PD5/IICRST2: IC1.30(PD5_XCK1) R14.1 U2.47(IICRST)
PD6/SDB1: IC1.31(PD6_T1) R10.1 U1.46(SDB)
PD7/SDB2: IC1.32(PD7_T0) R11.1 U2.46(SDB)
PE4_INT4/INTB1: IC1.18(PE4_INT4_TOSC1) R12.1 U1.45(INTB)
PE5_INT5/INTB2: IC1.19(PE5_INT5_TOSC2) R9.1 U2.45(INTB)
R1 [keyboard]: DANY.C(-) DESC.C(-) DF1.C(-) DF2.C(-) DF3.C(-) DF4.C(-) DF5.C(-) DF6.C(-) DF7.C(-) DF8.C(-) DF9.C(-) DF10.C(-) DF11.C(-) DF12.C(-) DPAUSE.C(-) DPRTSC.C(-) DSCROLLLOCK.C(-) IC1.61(PF0_ADC0)
R2 [keyboard]: D0.C(-) D1.C(-) D4.C(-) D5.C(-) D7.C(-) D9.C(-) D=.C(-) DBACKSPACE.C(-) DDEG.C(-) DHOME.C(-) DINSERT.C(-) DKP_SLASH.C(-) DPGUP.C(-) DQUOTE.C(-) DSLASH.C(-) DTOP.C(-) D§.C(-) IC1.60(PF1_ADC1)
R3 [keyboard]: D8.C(-) DDELETE.C(-) DE.C(-) DEND.C(-) DENTER.C(-) DI.C(-) DO.C(-) DP.C(-) DPGDN.C(-) DQ.C(-) DR.C(-) DT.C(-) DTAB.C(-) DU.C(-) DW.C(-) DY.C(-) DÜ.C(-) IC1.59(PF2_ADC2)
R4 [keyboard]: DA.C(-) DCAPSLOCK.C(-) DD.C(-) DDOP.C(-) DF.C(-) DG.C(-) DH.C(-) DJ.C(-) DK.C(-) DL.C(-) DS.C(-) DÄ.C(-) DÖ.C(-) IC1.58(PF3_ADC3)
R5 [keyboard]: DB.C(-) DC.C(-) DCOPY.C(-) DDOP_DUPE.C(-) DM.C(-) DN.C(-) DPASTE.C(-) DPERIOD.C(-) DSEM.C(-) DSHIFT.C(-) DSHIFT_DUPE.C(-) DUND.C(-) DUP.C(-) DV.C(-) DX.C(-) DZ.C(-) IC1.57(PF4_ADC4_TCK)
R6 [keyboard]: DALT.C(-) DALTGR.C(-) DCTRL.C(-) DCTRL_DUPE.C(-) DDOWN.C(-) DLEFT.C(-) DMENU.C(-) DRIGHT.C(-) DSPACE.C(-) DWIN.C(-) DWIN_DUPE.C(-) IC1.56(PF5_ADC5_TMS)
RESET: BTN.2 IC1.20(/RESET) ISP.4 R6.2 S1.3(P) S1.4(P1)
SCL [i2c]: I2C.2 IC1.25(PD0_OC0B_SCL_INT0) R1.2 U1.42(SCL) U2.42(SCL)
SCLK: IC1.11(PB1_PCINT1_SCLK) ISP.3
SDA [i2c]: I2C.1 IC1.26(PD1_OC2B_SDA_INT1) R2.1 U1.41(SDA) U2.41(SDA)
USB_N: IC1.4(D-) R3.2
USB_P: IC1.5(D+) R4.2
USBN: JP_USB.3 R4.1
USBP: JP_USB.2 R3.1
VCC [power]: +5V.1 C4.2 C5.+ C6.2 C7.2 C8.2 C9.1 C10.1 C11.1 C12.1 C13.1 C14.1 C17.1 C18.1 C19.1 C21.1 C22.1 C23.1 C24.1 C25.1 C26.+ C27.+ IC1.3(UVCC) IC1.8(VBUS) IC1.21(VCC) IC1.52(VCC) IC1.64(AVCC) JP_USB.1 LED1.A LED2.A R1.1 R2.2 R5.2 R6.1 R7.2 R9.2 R12.2 R17.2 U1.20(PVCC1) U1.29(PVCC2) U1.37(AVCC) U1.38(DVCC) U1.39(VIO) U2.20(PVCC1) U2.29(PVCC2) U2.37(AVCC) U2.38(DVCC) U2.39(VIO) U2.44(ADDR2)
Unconnected: IC1.9(PE3_IUID) IC1.10(PB0_SS_PCINT0) IC1.14(PB4_PCINT4_OC2A) IC1.17(PB7_PCINT7_OC0A_OC1C) INSERT.B-

## Buses
1SW1_G,1SW2_R,1SW3_B,1SW4_G,1SW5_R,1SW6_B,1SW7_G,1SW8_R,1SW9_B,1SW10_G,1SW11_R,1SW12_B
2SW1_G,2SW2_R,2SW3_B,2SW4_G,2SW5_R,2SW6_B,2SW7_G,2SW8_R,2SW9_B,2SW10_G,2SW11_R,2SW12_B
1CS1,1CS2,1CS3,1CS4,1CS5,1CS6,1CS7,1CS8,1CS9,1CS10,1CS11,1CS12,1CS13,1CS14,1CS15,1CS16
2CS1,2CS2,2CS3,2CS4,2CS5,2CS6,2CS7,2CS8,2CS9,2CS10,2CS11,2CS12,2CS13,2CS14,2CS15,2CS16
C1,C2,C3,C4,C5,C6,C7,C8,C9,C10,C11,C12,C13,C14,C15,C16,C17,C18
R1,R2,R3,R4,R5,R6

## Library data of the parts
0 1 4 5 7-9 = A ALT ALTGR ANY B BACKSPACE C CAPSLOCK COPY CTRL CTRL_DUPE D DEG DELETE DOP DOP_DUPE DOWN E END ENTER ESC F F1-F12 G H HOME I INSERT J K KP_SLASH L LEFT M MENU N O P PASTE PAUSE PERIOD PGDN PGUP PRTSC Q QUOTE R RIGHT S SCROLLLOCK SEM SHIFT SHIFT_DUPE SLASH SPACE T TAB TOP U UND UP V W WIN WIN_DUPE X Y Z § Ä Ö Ü = Keyboard:KEYSWITCH-RGBLED
+5V EGND I2C = pinhead:PINHD-1X2: PIN HEADER
BTN HWB SER = pinhead:PINHD-1X3: PIN HEADER
C1-C4 C6-C14 C17-C25 = rcl:C-EU: CAPACITOR, European symbol
C5 C26 C27 = rcl:CPOL-EU: POLARIZED CAPACITOR, European symbol
D0 D1 D4 D5 D7-D9 D= DA DALT DALTGR DANY DB DBACKSPACE DC DCAPSLOCK DCOPY DCTRL DCTRL_DUPE DD DDEG DDELETE DDOP DDOP_DUPE DDOWN DE DEND DENTER DESC DF DF1-DF12 DG DH DHOME DI DINSERT DJ DK DKP_SLASH DL DLEFT DM DMENU DN DO DP DPASTE DPAUSE DPERIOD DPGDN DPGUP DPRTSC DQ DQUOTE DR DRIGHT DS DSCROLLLOCK DSEM DSHIFT DSHIFT_DUPE DSLASH DSPACE DT DTAB DTOP DU DUND DUP DV DW DWIN DWIN_DUPE DX DY DZ D§ DÄ DÖ DÜ = Seeed-OPL-Diode:DIODE*
IC1 = controller-micro_atmel_jd:AT90USB
INFO1 INFO2 LED1 LED2 = led:LED: LED OSRAM: - CHIPLED LG R971, LG N971, LY N971, LG Q971, LY Q971, LO R971, LY R971 LH N974, LH R974 LS Q976, LO Q976, LY Q976 LO Q996 - Hyper CHIPLED LW Q18S LB Q993, LB Q99A, LB R99A - SideLED LS A670, LO A670, LY A670, LG A670, LP A670 LB A673, LV A673, LT A673, LW A673 LH A674 LY A675 LS A676, LA A676, LO A676, LY A676, LW A676 LS A679, LY A679, LG A679 - Hyper Micro SIDELED® LS Y876, LA Y876, LO Y876, LY Y876 LT Y87S - SmartLED LW L88C, LW L88S LB L89C, LB L89S, LG L890 LS L89K, LO L89K, LY L89K LS L896, LA L896, LO L896, LY L896 - TOPLED LS T670, LO T670, LY T670, LG T670, LP T670 LSG T670, LSP T670, LSY T670, LOP T670, LYG T670 LG T671, LOG T671, LSG T671 LB T673, LV T673, LT T673, LW T673 LH T674 LS T676, LA T676, LO T676, LY T676, LB T676, LH T676, LSB T676, LW T676 LB T67C, LV T67C, LT T67C, LS T67K, LO T67K, LY T67K, LW E67C LS E67B, LA E67B, LO E67B, LY E67B, LB E67C, LV E67C, LT E67C LW T67C LS T679, LY T679, LG T679 LS T770, LO T770, LY T770, LG T770, LP T770 LB T773, LV T773, LT T773, LW T773 LH T774 LS E675, LA E675, LY E675, LS T675 LS T776, LA T776, LO T776, LY T776, LB T776 LHGB T686 LT T68C, LB T68C - Hyper Mini TOPLED® LB M676 - Mini TOPLED Santana® LG M470 LS M47K, LO M47K, LY M47K Source: http://www.osram.convergy.de LUXEON: - LUMILED® LXK2-PW12-R00, LXK2-PW12-S00, LXK2-PW14-U00, LXK2-PW14-V00 LXK2-PM12-R00, LXK2-PM12-S00, LXK2-PM14-U00 LXK2-PE12-Q00, LXK2-PE12-R00, LXK2-PE12-S00, LXK2-PE14-T00, LXK2-PE14-U00 LXK2-PB12-K00, LXK2-PB12-L00, LXK2-PB12-M00, LXK2-PB14-N00, LXK2-PB14-P00, LXK2-PB14-Q00 LXK2-PR12-L00, LXK2-PR12-M00, LXK2-PR14-Q00, LXK2-PR14-R00 LXK2-PD12-Q00, LXK2-PD12-R00, LXK2-PD12-S00 LXK2-PH12-R00, LXK2-PH12-S00 LXK2-PL12-P00, LXK2-PL12-Q00, LXK2-PL12-R00 Source: www.luxeon.com KINGBRIGHT: KA-3528ASYC Source: www.kingbright.com
ISP JP_USB = pinhead:PINHD-1X4: PIN HEADER
OPT1 OPT2 = jumper:SJ: SMD solder JUMPER
Q4 = Crystals-new:CRYSTAL
R1-R18 REXT1 REXT2 = rcl:R-EU_: RESISTOR, European symbol
S1 = switch-omron:10-XX: OMRON SWITCH; MPN: B3F-1000; OC_FARNELL: 176432; OC_NEWARK: 36M3542
U1 U2 = kiibohd:IS31FL3733: 310080003

## Net classes
0 default: width 0.305 mm, drill 0.254 mm, clearance 0.203 mm
1 power: width 0.457 mm, drill 0.406 mm, clearance 0.203 mm
2 gnd: width 0.457 mm, drill 0.406 mm, clearance 0.203 mm
3 leddriver: width 0.406 mm, drill 0.305 mm, clearance 0.203 mm
4 keyboard: width 0.406 mm, drill 0.356 mm, clearance 0.203 mm
5 i2c: width 0.305 mm, drill 0.254 mm, clearance 0.203 mm

## Board
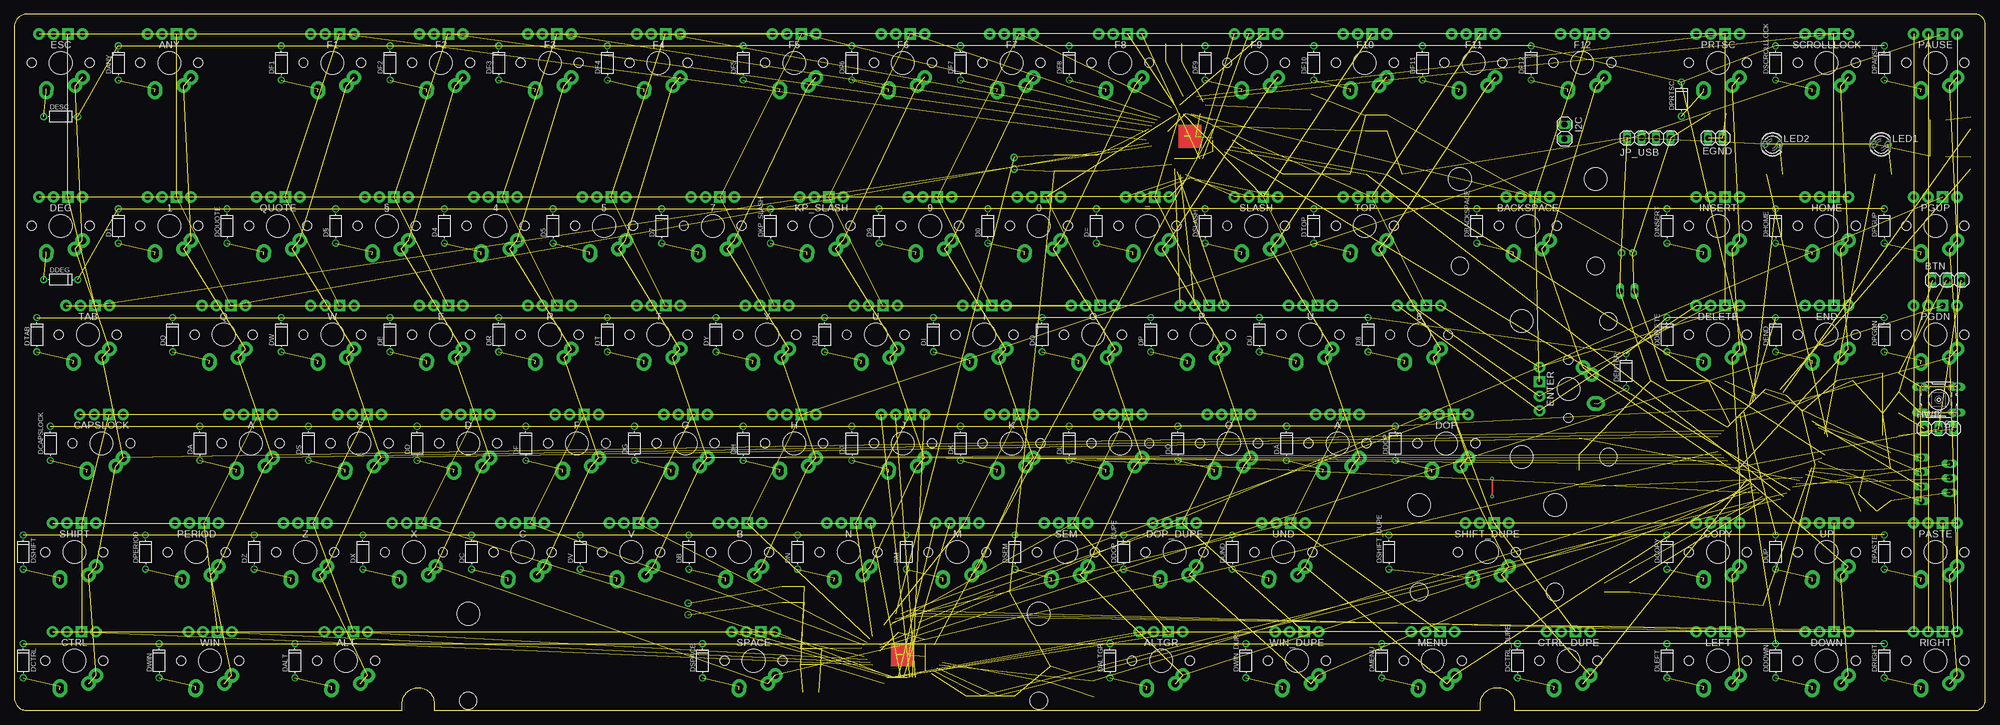
[diagram p2: board, top side]
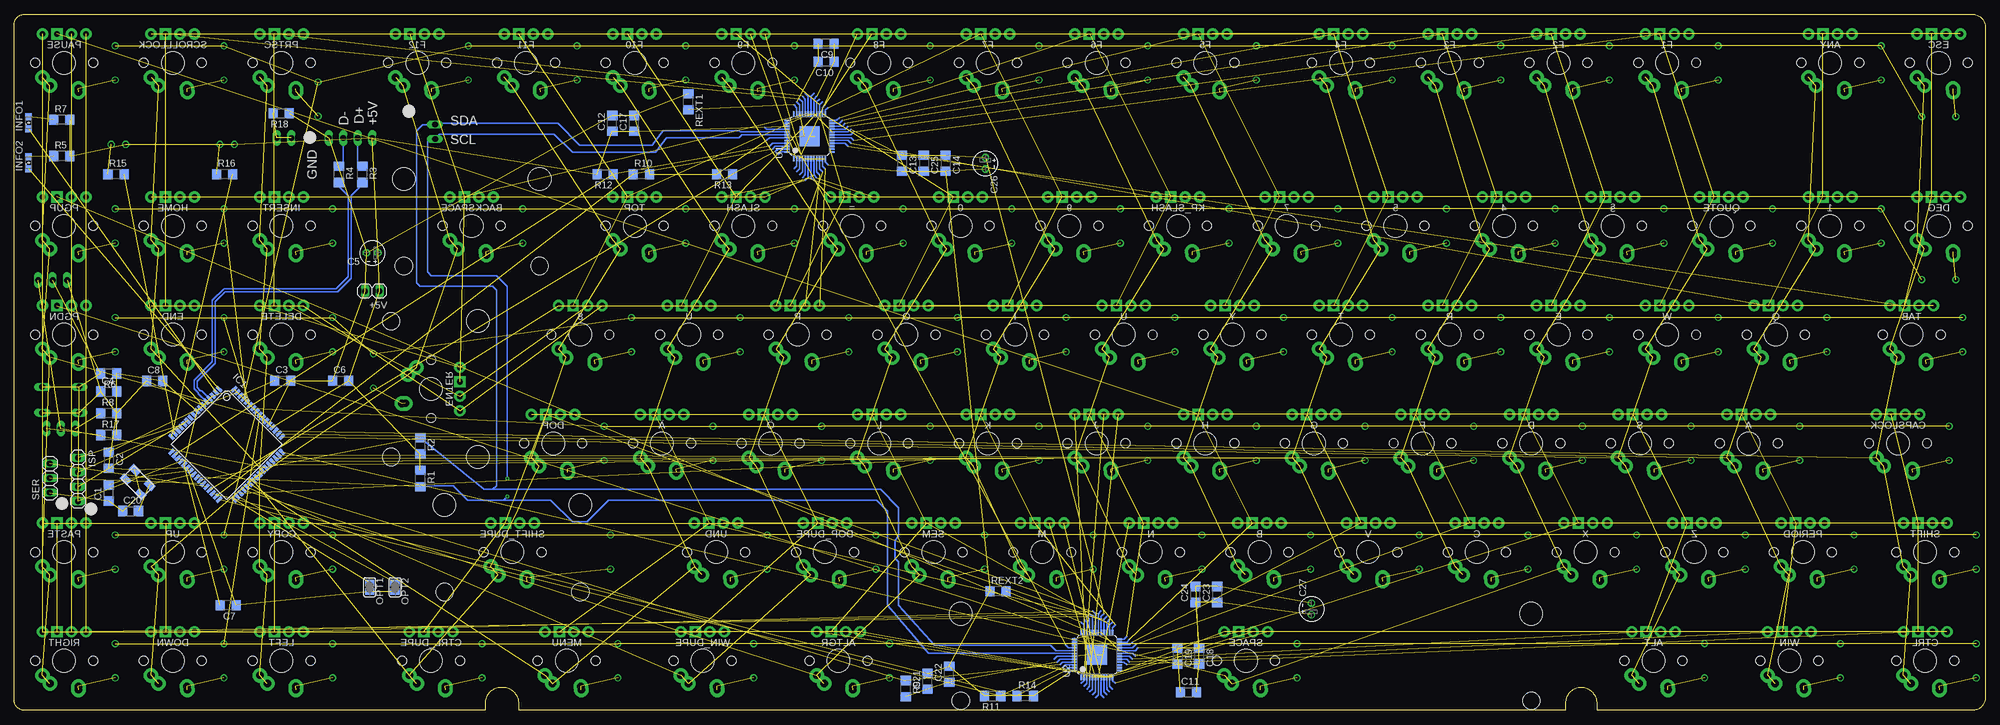
[diagram p3: board, bottom side, seen from below]

Size 345.5 x 122 mm. Coordinates in mm from the lower left corner, seen from the top.
Outline: 0,119.76 0,2.24 arc90 2.24,0 68,0 68,1.17 arc-90 70.83,4 arc-90 73.6,1.23 73.6,0 257,0 257,1.17 arc-90 259.83,4 260.17,4 arc-90 263,1.17 263,0 343.7,0 arc90 345.5,1.8 345.5,120.2 arc90 343.7,122 2.24,122 arc90 0,119.76
Copper layers (1*16): Top 0.035mm / dielectric 1.6mm / Bottom 0.035mm
Design rules "EasyEDAstd": minimum track width 6mil, minimum drill 0.3mm, track to track 6mil, track to pad 6mil, pad to pad 6mil, via to via 6mil, smd to smd 6mil, copper to edge 0.3mm, drill to drill 0.2mm, minimum pad ring 0.2mm, minimum via ring 0.15mm, stop-mask expansion 0.075mm, vias tented up to drill 0mil, thermal gap 0.2mm

### Footprints (pad centres in the part's own frame; a part is rotated, then mirrored left to right if it is on the bottom)
ALPSMX-1U-RGB = drill 1.3 pad 2.54: ALPS1 -2.5,4; ALPS2 2.5,4.5; MX1 -3.81,2.54; MX2 2.54,5.08 | drill 1 pad 2: B- 3.81,-5.08; G- 1.27,-5.08; R- -3.81,-5.08 | drill 1 pad 2 square: LED+ -1.27,-5.08 | hole 4: 0,0 | hole 1.6: -5.08,0; 5.08,0
1X02 = drill 1.016 long: 1 -1.27,0; 2 1.27,0
ALPSMX-2U-RGB = drill 1.3 pad 2.54: ALPS1 -2.5,4; ALPS2 2.5,4.5; MX1 -3.81,2.54; MX2 2.54,5.08 | drill 1 pad 2: B- 3.81,-5.08; G- 1.27,-5.08; R- -3.81,-5.08 | drill 1 pad 2 square: LED+ -1.27,-5.08 | hole 4: 0,0; -11.9,-8.24; 11.9,-8.24 | hole 1.6: -5.08,0; 5.08,0 | hole 3.05: -11.9,7; 11.9,7
1X03 = drill 1.016 long: 1 -2.54,0; 2 0,0; 3 2.54,0
C1206 = smd 1.6 x 1.8: 1 -1.4,0; 2 1.4,0
E2-4 = drill 0.813 pad 1.27: + -1.016,0 | drill 0.813 pad 1.27 octagon: - 1.016,0
DO-35 = drill 0.8: A -3,0; C 3,0
TQFP64 = smd 1.194 x 0.559: 1 -7.76,5.905; 2 -7.76,5.118; 3 -7.76,4.331; 4 -7.76,3.543; 5 -7.76,2.756; 6 -7.76,1.968; 7 -7.76,1.181; 8 -7.76,0.394; 9 -7.76,-0.394; 10 -7.76,-1.181; 11 -7.76,-1.968; 12 -7.76,-2.756; 13 -7.76,-3.543; 14 -7.76,-4.331; 15 -7.76,-5.118; 16 -7.76,-5.905; 33 7.76,-5.905; 34 7.76,-5.118; 35 7.76,-4.331; 36 7.76,-3.543; 37 7.76,-2.756; 38 7.76,-1.968; 39 7.76,-1.181; 40 7.76,-0.394; 41 7.76,0.394; 42 7.76,1.181; 43 7.76,1.968; 44 7.76,2.756; 45 7.76,3.543; 46 7.76,4.331; 47 7.76,5.118; 48 7.76,5.905 | smd 0.559 x 1.194: 17 -5.905,-7.76; 18 -5.118,-7.76; 19 -4.331,-7.76; 20 -3.543,-7.76; 21 -2.756,-7.76; 22 -1.968,-7.76; 23 -1.181,-7.76; 24 -0.394,-7.76; 25 0.394,-7.76; 26 1.181,-7.76; 27 1.968,-7.76; 28 2.756,-7.76; 29 3.543,-7.76; 30 4.331,-7.76; 31 5.118,-7.76; 32 5.905,-7.76; 49 5.905,7.76; 50 5.118,7.76; 51 4.331,7.76; 52 3.543,7.76; 53 2.756,7.76; 54 1.968,7.76; 55 1.181,7.76; 56 0.394,7.76; 57 -0.394,7.76; 58 -1.181,7.76; 59 -1.968,7.76; 60 -2.756,7.76; 61 -3.543,7.76; 62 -4.331,7.76; 63 -5.118,7.76; 64 -5.905,7.76
SML0805 = smd 1.2 x 1.2: A 1.05,0; C -1.05,0
1X04 = drill 1.016 long: 1 -3.81,0; 2 -1.27,0; 3 1.27,0; 4 3.81,0
LED3MM = drill 0.813 octagon: A -1.27,0; K 1.27,0
SJ = smd 1.168 x 1.6: 1 -0.762,0; 2 0.762,0
MJ = smd 1.8 x 1.2: P1 -1.85,-1.15; P2 1.85,-1.15; P3 1.85,1.15; P4 -1.85,1.15
R1206 = smd 1.6 x 1.803: 1 -1.422,0; 2 1.422,0
B3F-10XX = drill 1.016 long: 1 -3.251,2.261; 2 3.251,2.261; 3 -3.251,-2.261; 4 3.251,-2.261
ALPSMX-6.25U-RGB = drill 1.3 pad 2.54: ALPS1 -2.5,4; ALPS2 2.5,4.5; MX1 -3.81,2.54; MX2 2.54,5.08 | drill 1 pad 2: B- 3.81,-5.08; G- 1.27,-5.08; R- -3.81,-5.08 | drill 1 pad 2 square: LED+ -1.27,-5.08 | hole 4: 0,0; -50,-8.24; 50,-8.24 | hole 1.6: -5.08,0; 5.08,0 | hole 3.05: -50,7; 50,7
LQFP48_7X7 = smd 0.9 x 0.3: 1 -3.95,2.75; 2 -3.95,2.25; 3 -3.95,1.75; 4 -3.95,1.25; 5 -3.95,0.75; 6 -3.95,0.25; 7 -3.95,-0.25; 8 -3.95,-0.75; 9 -3.95,-1.25; 10 -3.95,-1.75; 11 -3.95,-2.25; 12 -3.95,-2.75; 25 3.95,-2.75; 26 3.95,-2.25; 27 3.95,-1.75; 28 3.95,-1.25; 29 3.95,-0.75; 30 3.95,-0.25; 31 3.95,0.25; 32 3.95,0.75; 33 3.95,1.25; 34 3.95,1.75; 35 3.95,2.25; 36 3.95,2.75 | smd 0.3 x 0.9: 13 -2.75,-3.95; 14 -2.25,-3.95; 15 -1.75,-3.95; 16 -1.25,-3.95; 17 -0.75,-3.95; 18 -0.25,-3.95; 19 0.25,-3.95; 20 0.75,-3.95; 21 1.25,-3.95; 22 1.75,-3.95; 23 2.25,-3.95; 24 2.75,-3.95; 37 2.75,3.95; 38 2.25,3.95; 39 1.75,3.95; 40 1.25,3.95; 41 0.75,3.95; 42 0.25,3.95; 43 -0.25,3.95; 44 -0.75,3.95; 45 -1.25,3.95; 46 -1.75,3.95; 47 -2.25,3.95; 48 -2.75,3.95 | smd 3.5 x 3.5: TP 0,0

### Placement (x,y rotation side)
0  179.59,84.9 180 top
1  27.2,84.9 180 top
4  84.34,84.9 180 top
5  103.39,84.9 180 top
7  122.44,84.9 180 top
8  246.26,65.85 180 top
9  160.54,84.9 180 top
+5V  282.75,73.47 180 bottom
=  198.65,84.9 180 top
A  41.48,46.8 180 top
ALT  58.15,8.7 180 top
ALTGR  201.03,8.7 180 top
ANY  27.2,113.47 180 top
B  127.2,27.75 180 top
BACKSPACE  265.31,84.9 180 top
BTN  338.77,75.41 0 top
C  89.11,27.75 180 top
C1  328.93,38.1 90 bottom
C2  328.93,43.81 270 bottom
C3  298.45,57.78 0 bottom
C4  328.93,55.88 0 bottom
C5  282.75,80.19 180 bottom
C6  288.29,57.78 0 bottom
C7  307.98,18.41 180 bottom
C8  320.9,57.74 0 bottom
C9  203.2,116.84 180 bottom
C10  203.2,113.67 180 bottom
C11  139.7,3.17 0 bottom
C12  240.66,102.87 90 bottom
C13  189.87,95.89 270 bottom
C14  182.25,95.89 270 bottom
C17  236.85,102.87 90 bottom
C18  137.79,9.53 270 bottom
C19  141.6,9.53 270 bottom
C20  325.12,34.92 0 bottom
C21  185.42,5.08 90 bottom
C22  181.61,6.35 90 bottom
C23  134.62,20.32 90 bottom
C24  138.43,20.32 90 bottom
C25  186.06,95.89 270 bottom
C26  175.26,95.89 270 bottom
C27  118.11,17.78 90 bottom
CAPSLOCK  15.29,46.8 180 top
COPY  298.65,27.75 180 top
CTRL  10.53,8.7 180 top
CTRL_DUPE  272.45,8.7 180 top
D  79.58,46.8 180 top
D0  170.65,84.9 90 top
D1  18.25,84.9 90 top
D4  75.39,84.9 90 top
D5  94.44,84.9 90 top
D7  113.5,84.9 90 top
D8  237.31,65.85 90 top
D9  151.59,84.9 90 top
D=  189.69,84.9 90 top
DA  32.52,46.8 90 top
DALT  49.2,8.7 90 top
DALTGR  192.07,8.7 90 top
DANY  18.25,113.47 90 top
DB  118.25,27.75 90 top
DBACKSPACE  256.37,84.9 90 top
DC  80.16,27.75 90 top
DCAPSLOCK  6.33,46.8 90 top
DCOPY  289.7,27.75 90 top
DCTRL  1.57,8.7 90 top
DCTRL_DUPE  263.5,8.7 90 top
DD  70.62,46.8 90 top
DDEG  8.14,75.48 0 top
DDELETE  289.7,65.85 90 top
DDOP  242.07,46.8 90 top
DDOP_DUPE  194.46,27.75 90 top
DDOWN  308.75,8.7 90 top
DE  65.86,65.85 90 top
DEG  8.14,84.9 180 top
DELETE  298.65,65.85 180 top
DEND  308.75,65.85 90 top
DENTER  282.56,59.5 90 top
DESC  8.14,104.06 0 top
DF  89.67,46.8 90 top
DF1  46.81,113.47 90 top
DF2  65.86,113.47 90 top
DF3  84.92,113.47 90 top
DF4  103.97,113.47 90 top
DF5  127.78,113.47 90 top
DF6  146.82,113.47 90 top
DF7  165.88,113.47 90 top
DF8  184.93,113.47 90 top
DF9  208.75,113.47 90 top
DF10  227.79,113.47 90 top
DF11  246.84,113.47 90 top
DF12  265.89,113.47 90 top
DG  108.72,46.8 90 top
DH  127.78,46.8 90 top
DHOME  308.75,84.9 90 top
DI  161.12,65.85 90 top
DINSERT  289.7,84.9 90 top
DJ  146.82,46.8 90 top
DK  165.88,46.8 90 top
DKP_SLASH  132.54,84.9 90 top
DL  184.93,46.8 90 top
DLEFT  289.7,8.7 90 top
DM  156.35,27.75 90 top
DMENU  239.69,8.7 90 top
DN  137.31,27.75 90 top
DO  180.16,65.85 90 top
DOP  251.03,46.8 180 top
DOP_DUPE  203.41,27.75 180 top
DOWN  317.7,8.7 180 top
DP  199.22,65.85 90 top
DPASTE  327.81,27.75 90 top
DPAUSE  327.81,113.47 90 top
DPERIOD  23,27.75 90 top
DPGDN  327.81,65.85 90 top
DPGUP  327.81,84.9 90 top
DPRTSC  292.25,107.12 90 top
DQ  27.77,65.85 90 top
DQUOTE  37.3,84.9 90 top
DR  84.92,65.85 90 top
DRIGHT  327.81,8.7 90 top
DS  51.58,46.8 90 top
DSCROLLLOCK  308.75,113.47 90 top
DSEM  175.41,27.75 90 top
DSHIFT  1.57,27.75 90 top
DSHIFT_DUPE  240.97,27.75 90 top
DSLASH  208.75,84.9 90 top
DSPACE  120.64,8.7 90 top
DT  103.97,65.85 90 top
DTAB  3.96,65.85 90 top
DTOP  227.79,84.9 90 top
DU  142.06,65.85 90 top
DUND  213.5,27.75 90 top
DUP  308.75,27.75 90 top
DV  99.2,27.75 90 top
DW  46.81,65.85 90 top
DWIN  25.39,8.7 90 top
DWIN_DUPE  215.88,8.7 90 top
DX  61.1,27.75 90 top
DY  123.02,65.85 90 top
DZ  42.05,27.75 90 top
D§  56.34,84.9 90 top
DÄ  223.03,46.8 90 top
DÖ  203.97,46.8 90 top
DÜ  218.26,65.85 90 top
E  74.81,65.85 180 top
EGND  298.2,100.33 0 top
END  317.7,65.85 180 top
ENTER  272.45,56.33 270 top
ESC  8.14,113.47 180 top
F  98.62,46.8 180 top
F1  55.77,113.47 180 top
F2  74.81,113.47 180 top
F3  93.86,113.47 180 top
F4  112.92,113.47 180 top
F5  136.72,113.47 180 top
F6  155.78,113.47 180 top
F7  174.82,113.47 180 top
F8  193.88,113.47 180 top
F9  217.69,113.47 180 top
F10  236.75,113.47 180 top
F11  255.79,113.47 180 top
F12  274.85,113.47 180 top
G  117.67,46.8 180 top
H  136.72,46.8 180 top
HOME  317.7,84.9 180 top
HWB  337.34,49.37 0 top
I  170.06,65.85 180 top
I2C  271.75,101.4 270 top
IC1  308.26,46.63 315 bottom
INFO1  343,103 90 bottom
INFO2  343,96 90 bottom
INSERT  298.65,84.9 180 top
ISP  334.31,40.48 270 bottom
J  155.78,46.8 180 top
JP_USB  286.56,100.33 0 top
K  174.82,46.8 180 top
KP_SLASH  141.5,84.9 180 top
L  193.88,46.8 180 top
LED1  327.24,99.19 0 top
LED2  308.18,99.19 0 top
LEFT  298.65,8.7 180 top
M  165.31,27.75 180 top
MENU  248.65,8.7 180 top
N  146.25,27.75 180 top
O  189.12,65.85 180 top
OPT1  283.21,21.59 270 bottom
OPT2  278.76,21.59 270 bottom
P  208.16,65.85 180 top
PASTE  336.75,27.75 180 top
PAUSE  336.75,113.47 180 top
PERIOD  31.95,27.75 180 top
PGDN  336.75,65.85 180 top
PGUP  336.75,84.9 180 top
PRTSC  298.65,113.47 180 top
Q  36.72,65.85 180 top
Q4  323.85,40.01 135 bottom
QUOTE  46.24,84.9 180 top
R  93.86,65.85 180 top
R1  274.32,40.64 270 bottom
R2  274.32,46.35 270 bottom
R3  284.48,93.93 270 bottom
R4  288.61,93.93 270 bottom
R5  337.19,97.16 0 bottom
R6  328.93,59.05 180 bottom
R7  337.19,103.5 0 bottom
R8  328.93,52.07 0 bottom
R9  189.23,3.81 270 bottom
R10  235.59,93.98 0 bottom
R11  173.99,2.54 180 bottom
R12  241.94,93.98 180 bottom
R13  220.98,93.98 180 bottom
R14  168.28,2.54 0 bottom
R15  327.66,93.98 0 bottom
R16  308.61,93.98 0 bottom
R17  328.93,48.26 0 bottom
R18  298.72,104.66 180 bottom
REXT1  227.33,106.68 270 bottom
REXT2  173.05,20.86 0 bottom
RIGHT  336.75,8.7 180 top
S  60.52,46.8 180 top
S1  337.34,54.45 180 top
SCROLLLOCK  317.7,113.47 180 top
SEM  184.35,27.75 180 top
SER  339.26,40.72 90 bottom
SHIFT  10.53,27.75 180 top
SHIFT_DUPE  258.18,27.75 180 top
SLASH  217.69,84.9 180 top
SPACE  129.59,8.7 180 top
T  112.92,65.85 180 top
TAB  12.9,65.85 180 top
TOP  236.75,84.9 180 top
U  151.01,65.85 180 top
U1  206.09,100.64 90 bottom
U2  155.73,9.73 90 bottom
UND  222.46,27.75 180 top
UP  317.7,27.75 180 top
V  108.16,27.75 180 top
W  55.77,65.85 180 top
WIN  34.34,8.7 180 top
WIN_DUPE  224.84,8.7 180 top
X  70.06,27.75 180 top
Y  131.97,65.85 180 top
Z  51.01,27.75 180 top
§  65.3,84.9 180 top
Ä  231.97,46.8 180 top
Ö  212.93,46.8 180 top
Ü  227.22,65.85 180 top

### Tracks (layer width: path | path; a pad name or v marks a point on that pad's centre or on a via)
1CS1  (3 unrouted)
  Bottom 0.254: U1.16 199.84,99.39 199.34,98.89
1CS2  (3 unrouted)
  Bottom 0.254: U1.17 199.34,99.89 198.84,99.39
1CS3  (3 unrouted)
  Bottom 0.254: U1.18 198.84,100.39 198.34,99.89
1CS4  (3 unrouted)
  Bottom 0.254: U1.19 198.84,100.89 198.34,101.39
1CS5  (3 unrouted)
  Bottom 0.254: U1.21 199.84,101.89 199.34,102.39
1CS6  (3 unrouted)
  Bottom 0.254: U1.22 200.34,102.39 199.84,102.89
1CS7  (3 unrouted)
  Bottom 0.254: U1.23 200.84,102.89 200.34,103.39
1CS8  (3 unrouted)
  Bottom 0.254: U1.24 201.34,103.39 200.84,103.89
1CS9  (3 unrouted)
  Bottom 0.254: U1.25 203.34,105.14 202.84,105.64
1CS10  (3 unrouted)
  Bottom 0.254: U1.26 203.84,105.64 203.34,106.14
1CS11  (3 unrouted)
  Bottom 0.254: U1.27 204.34,106.14 203.84,106.64
1CS12  (3 unrouted)
  Bottom 0.254: U1.28 204.84,106.64 204.34,107.14
1CS13  (3 unrouted)
  Bottom 0.254: U1.30 205.84,107.64 205.34,108.14
1CS14  (3 unrouted)
  Bottom 0.254: U1.31 206.34,107.64 206.84,108.14
1CS15  (3 unrouted)
  Bottom 0.254: U1.32 206.84,107.14 207.34,107.64
1CS16  (3 unrouted)
  Bottom 0.254: U1.33 207.34,106.64 207.84,107.14
1SW1_G  (16 unrouted)
  Bottom 0.254: U1.2 208.34,95.39 208.84,94.89
1SW2_R  (16 unrouted)
  Bottom 0.254: U1.3 207.84,94.89 208.34,94.39
1SW3_B  (16 unrouted)
  Bottom 0.254: U1.4 207.34,94.39 207.84,93.89
1SW4_G  (16 unrouted)
  Bottom 0.254: U1.6 206.34,93.39 206.84,92.89
1SW5_R  (16 unrouted)
  Bottom 0.254: U1.7 205.84,93.39 205.34,92.89
1SW6_B  (15 unrouted)
  Bottom 0.254: U1.8 205.34,93.89 204.84,93.39
1SW7_G  (16 unrouted)
  Bottom 0.254: U1.9 204.84,94.39 204.34,93.89
1SW8_R  (16 unrouted)
  Bottom 0.254: U1.10 204.34,94.89 203.84,94.39
1SW9_B  (16 unrouted)
  Bottom 0.254: U1.11 203.84,95.39 203.34,94.89
2CS1  (3 unrouted)
  Bottom 0.254: U2.16 150.98,8.48 150.48,7.98
2CS2  (3 unrouted)
  Bottom 0.254: U2.17 150.48,8.98 149.98,8.48
2CS3  (3 unrouted)
  Bottom 0.254: U2.18 149.98,9.48 149.48,8.98
2CS4  (3 unrouted)
  Bottom 0.254: U2.19 149.48,9.98 148.98,9.48
2CS5  (3 unrouted)
  Bottom 0.254: U2.21 149.48,10.98 148.98,11.48
2CS6  (3 unrouted)
  Bottom 0.254: U2.22 149.98,11.48 149.48,11.98
2CS7  (3 unrouted)
  Bottom 0.254: U2.23 150.48,11.98 149.98,12.48
2CS8  (2 unrouted)
  Bottom 0.254: U2.24 150.98,12.48 150.48,12.98
2CS9  (2 unrouted)
  Bottom 0.254: U2.25 152.98,14.48 152.48,14.98
2CS10  (3 unrouted)
  Bottom 0.254: U2.26 153.48,14.98 152.98,15.48
2CS11  (3 unrouted)
  Bottom 0.254: U2.27 153.98,15.48 153.48,15.98
2CS12  (3 unrouted)
  Bottom 0.254: U2.28 154.48,15.98 153.98,16.48
2CS13  (3 unrouted)
  Bottom 0.254: U2.30 155.48,16.98 154.98,17.48
2CS14  (2 unrouted)
  Bottom 0.254: U2.31 155.98,16.98 156.48,17.48
2CS15  (2 unrouted)
  Bottom 0.254: U2.32 156.48,16.48 156.98,16.98
2CS16  (2 unrouted)
  Bottom 0.254: U2.33 156.98,15.98 157.48,16.48
2SW1_G  (13 unrouted)
  Bottom 0.254: U2.2 157.98,5.23 158.48,4.73
2SW2_R  (13 unrouted)
  Bottom 0.254: U2.3 157.48,4.73 157.98,4.23
2SW3_B  (13 unrouted)
  Bottom 0.254: U2.4 156.98,4.23 157.48,3.73
2SW4_G  (16 unrouted)
  Bottom 0.254: U2.6 155.98,3.23 156.48,2.73
2SW5_R  (16 unrouted)
  Bottom 0.254: U2.7 155.48,2.73 155.98,2.23
2SW6_B  (16 unrouted)
  Bottom 0.254: U2.8 154.98,2.73 154.48,2.23
2SW7_G  (14 unrouted)
  Bottom 0.254: U2.9 154.48,3.23 153.98,2.73
2SW8_R  (14 unrouted)
  Bottom 0.254: U2.10 153.98,3.73 153.48,3.23
2SW9_B  (14 unrouted)
  Bottom 0.254: U2.11 153.48,4.23 152.98,3.73
+3V3  (1 unrouted)
C1  (12 unrouted)
C2  (12 unrouted)
C3  (12 unrouted)
C4  (12 unrouted)
C5  (10 unrouted)
C6  (10 unrouted)
C7  (10 unrouted)
C8  (10 unrouted)
C9  (10 unrouted)
C10  (12 unrouted)
C11  (12 unrouted)
C12  (12 unrouted)
C13  (12 unrouted)
C14  (6 unrouted)
C15  (10 unrouted)
C16  (10 unrouted)
C17  (10 unrouted)
GND  (60 unrouted)
  Top 0.406: 205.09,100.64 207.09,100.64 | 154.73,9.73 156.73,9.73
  Bottom 0.254: U2.34 157.48,15.48 157.98,15.98 | U2.48 160.23,6.98 160.73,6.48 | U2.43 162.73,9.48 163.23,8.98 | U2.5 156.48,3.73 156.98,3.23 | U2.12 152.98,5.23 152.48,4.73 | U1.34 207.84,106.14 208.34,106.64 | U1.12 203.34,96.14 202.84,95.64 | U1.5 206.84,93.89 207.34,93.39 | U1.44 U1.43 213.09,100.39 213.59,99.89 | U1.48 211.09,97.89 211.59,97.39
HWB  (2 unrouted)
ILED1  (1 unrouted)
INFO1  (1 unrouted)
ISSI_SYNC  (1 unrouted)
  Bottom 0.254: U2.40 160.73,10.98 161.23,11.48 | U1.40 213.65,101.89 214,102.23
MISO/PDO  (1 unrouted)
MOSI/PDI  (1 unrouted)
N$1  (2 unrouted)
N$3  (1 unrouted)
N$6  (1 unrouted)
  Bottom 0.254: U1.35 208.34,105.64 208.84,106.14
N$8  (1 unrouted)
  Bottom 0.254: U2.35 157.98,14.98 158.48,15.48
N$9  (1 unrouted)
N$10  (2 unrouted)
N$11  (2 unrouted)
N$12  (2 unrouted)
N$13  (2 unrouted)
N$14  (2 unrouted)
N$15  (2 unrouted)
N$16  (2 unrouted)
N$17  (2 unrouted)
N$18  (2 unrouted)
N$19  (2 unrouted)
N$20  (2 unrouted)
N$21  (2 unrouted)
N$22  (2 unrouted)
N$23  (1 unrouted)
N$24  (1 unrouted)
N$26  (2 unrouted)
N$27  (2 unrouted)
N$28  (2 unrouted)
N$29  (2 unrouted)
N$30  (2 unrouted)
N$31  (2 unrouted)
N$32  (2 unrouted)
N$33  (2 unrouted)
N$34  (2 unrouted)
N$35  (2 unrouted)
N$36  (2 unrouted)
N$37  (1 unrouted)
N$38  (2 unrouted)
N$40  (1 unrouted)
N$41  (2 unrouted)
N$42  (2 unrouted)
N$43  (2 unrouted)
N$44  (1 unrouted)
N$46  (2 unrouted)
N$48  (2 unrouted)
N$49  (2 unrouted)
N$50  (2 unrouted)
N$51  (2 unrouted)
N$52  (2 unrouted)
N$53  (2 unrouted)
N$54  (2 unrouted)
N$55  (2 unrouted)
N$56  (2 unrouted)
N$57  (2 unrouted)
N$58  (2 unrouted)
N$59  (2 unrouted)
N$60  (2 unrouted)
N$61  (2 unrouted)
N$62  (2 unrouted)
N$63  (2 unrouted)
N$64  (2 unrouted)
N$65  (2 unrouted)
N$66  (2 unrouted)
N$67  (1 unrouted)
N$68  (1 unrouted)
N$70  (2 unrouted)
N$71  (2 unrouted)
N$72  (2 unrouted)
N$73  (2 unrouted)
N$75  (2 unrouted)
N$76  (2 unrouted)
N$77  (2 unrouted)
N$78  (2 unrouted)
N$79  (2 unrouted)
N$80  (2 unrouted)
N$81  (2 unrouted)
N$82  (2 unrouted)
N$83  (2 unrouted)
N$84  (2 unrouted)
N$85  (2 unrouted)
N$86  (2 unrouted)
N$87  (2 unrouted)
N$88  (2 unrouted)
N$89  (2 unrouted)
N$90  (2 unrouted)
N$91  (2 unrouted)
N$92  (2 unrouted)
N$93  (2 unrouted)
N$94  (2 unrouted)
N$95  (2 unrouted)
N$96  (2 unrouted)
N$97  (2 unrouted)
N$98  (2 unrouted)
N$99  (2 unrouted)
N$100  (2 unrouted)
N$101  (2 unrouted)
N$102  (2 unrouted)
N$103  (2 unrouted)
N$104  (2 unrouted)
N$105  (2 unrouted)
N$106  (2 unrouted)
N$107  (2 unrouted)
N$108  (2 unrouted)
N$109  (2 unrouted)
N$110  (2 unrouted)
N$111  (2 unrouted)
N$112  (2 unrouted)
N$113  (2 unrouted)
N$114  (2 unrouted)
N$115  (2 unrouted)
PB5/OC1A/LED1  (1 unrouted)
PB6/OC1B/LED2  (1 unrouted)
PD2/RXD1  (1 unrouted)
PD3/TXD1  (1 unrouted)
PD4/IICRST1  (2 unrouted)
  Bottom 0.254: U1.47 211.59,98.39 212.09,97.89
PD5/IICRST2  (2 unrouted)
  Bottom 0.254: U2.47 160.73,7.48 161.23,6.98
PD6/SDB1  (2 unrouted)
  Bottom 0.254: U1.46 212.09,98.89 212.59,98.39
PD7/SDB2  (2 unrouted)
  Bottom 0.254: U2.46 161.23,7.98 161.73,7.48
PE4_INT4/INTB1  (2 unrouted)
  Bottom 0.254: U1.45 212.59,99.39 213.09,98.89
PE5_INT5/INTB2  (2 unrouted)
  Bottom 0.254: U2.45 161.73,8.48 162.23,7.98
R1  (17 unrouted)
R2  (17 unrouted)
R3  (17 unrouted)
R4  (13 unrouted)
R5  (16 unrouted)
R6  (11 unrouted)
RESET  (5 unrouted)
SCL  (via drill 0.3)  (1 unrouted)
  Top 0.305: v259.08,40.64 v259.08,37.47
  Bottom 0.254: U2.42 163.63,9.98 | U1.42 217.88,100.89 218.44,100.33
  Bottom 0.305: 163.63,9.98 185.24,9.98 192.41,18.41 192.41,34.92 194.31,36.83 241.3,36.83 245.11,33.02 247.65,33.02 251.46,36.83 259.71,36.83 | 259.71,36.83 266.06,36.83 268.61,39.37 271.93,39.37 R1.2 | v259.08,40.64 259.08,74.3 260.99,76.2 272.42,76.2 273.05,76.83 273.05,99.69 272.62,100.13 I2C.2 270.91,100.97 250.82,100.97 247.65,97.79 233.04,97.79 231.14,100.33 218.44,100.33 | v259.08,37.47 259.71,36.83
SCLK  (1 unrouted)
SDA  (1 unrouted)
  Bottom 0.254: U2.41 162.88,10.48 | U1.41 218.22,101.39 218.44,101.6
  Bottom 0.305: 162.37,10.48 162.88,10.48 163.83,11.43 184.15,11.43 190.5,18.41 190.5,26.04 191.13,26.67 191.13,29.84 190.5,30.48 190.5,35.56 193.68,38.73 261.62,38.73 | 261.62,38.73 263.17,38.73 R2.1 | 261.62,38.73 260.99,39.37 260.99,73.66 261.62,74.3 274.32,74.3 274.95,74.93 274.95,101.6 273.88,102.67 I2C.1 271.55,102.87 250.19,102.87 246.38,99.06 233.68,99.06 231.78,101.6 218.44,101.6
USB_N
  Bottom 0.305: R3.2 284.48,92.14 286.45,90.17 286.45,75.78 288.82,73.41 308.5,73.41 310.26,71.65 310.26,60.85 313.44,57.68 313.44,56.62 312.88,56.06 312.68,56.06 IC1.4
USB_P
  Bottom 0.305: R4.2 288.61,91.82 286.96,90.17 286.96,75.99 289.03,73.91 308.71,73.91 310.77,71.86 310.77,61.06 313.94,57.89 313.94,56.41 313.24,55.7 313.24,55.5 IC1.5
USBN
  Bottom 0.305: R4.1 arc-90 287.83,96.13 JP_USB.3
USBP
  Bottom 0.305: R3.1 285.29,96.17 JP_USB.2
VCC  (44 unrouted)
  Bottom 0.254: U2.29 154.98,16.48 154.48,16.98 | U2.38 U2.39 | U2.44 162.23,8.98 162.73,8.48 | U2.20 148.98,10.48 148.48,10.98 | U1.20 199.34,101.39 198.84,101.89 | U1.29 205.34,107.14 204.84,107.64 | U1.37 U1.38 U1.39
  Bottom 0.61: U2.37 U2.38
(copper drawn outside any net)
  shapes: Top area x2

### Text on the board
bNames: +5V | D+ | D- | SDA | SCL | GND